# EAGLE design BUS (EAGLE 9.5.2)
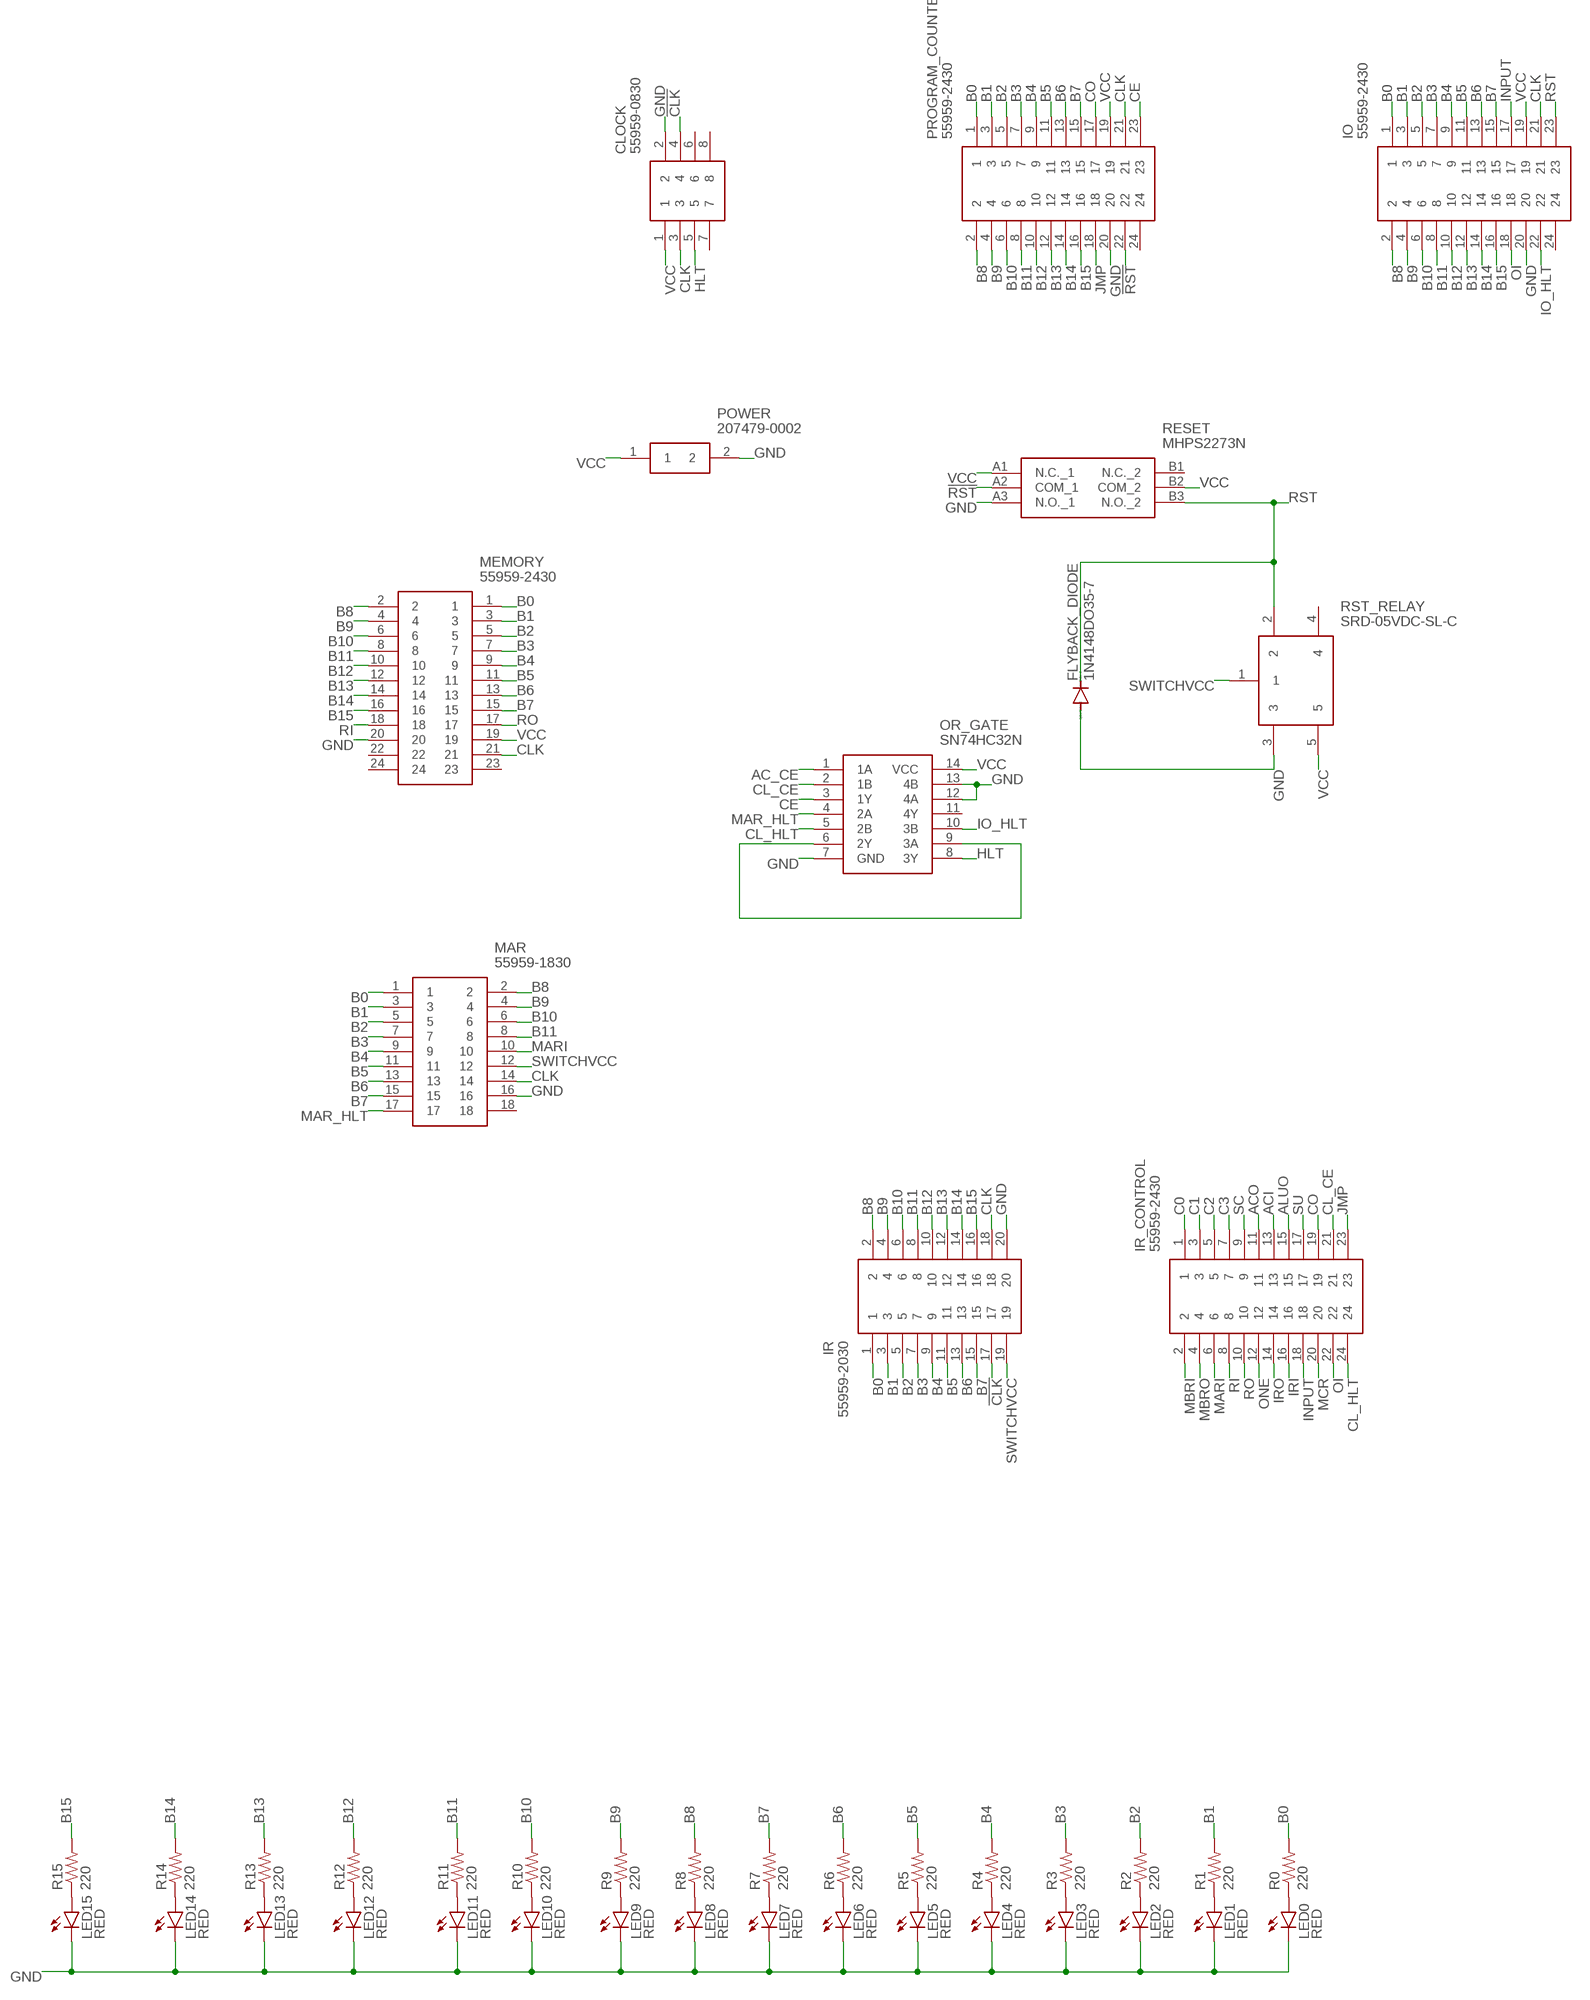
[diagram p0: schematic, sheet 1, part 1 of 2]
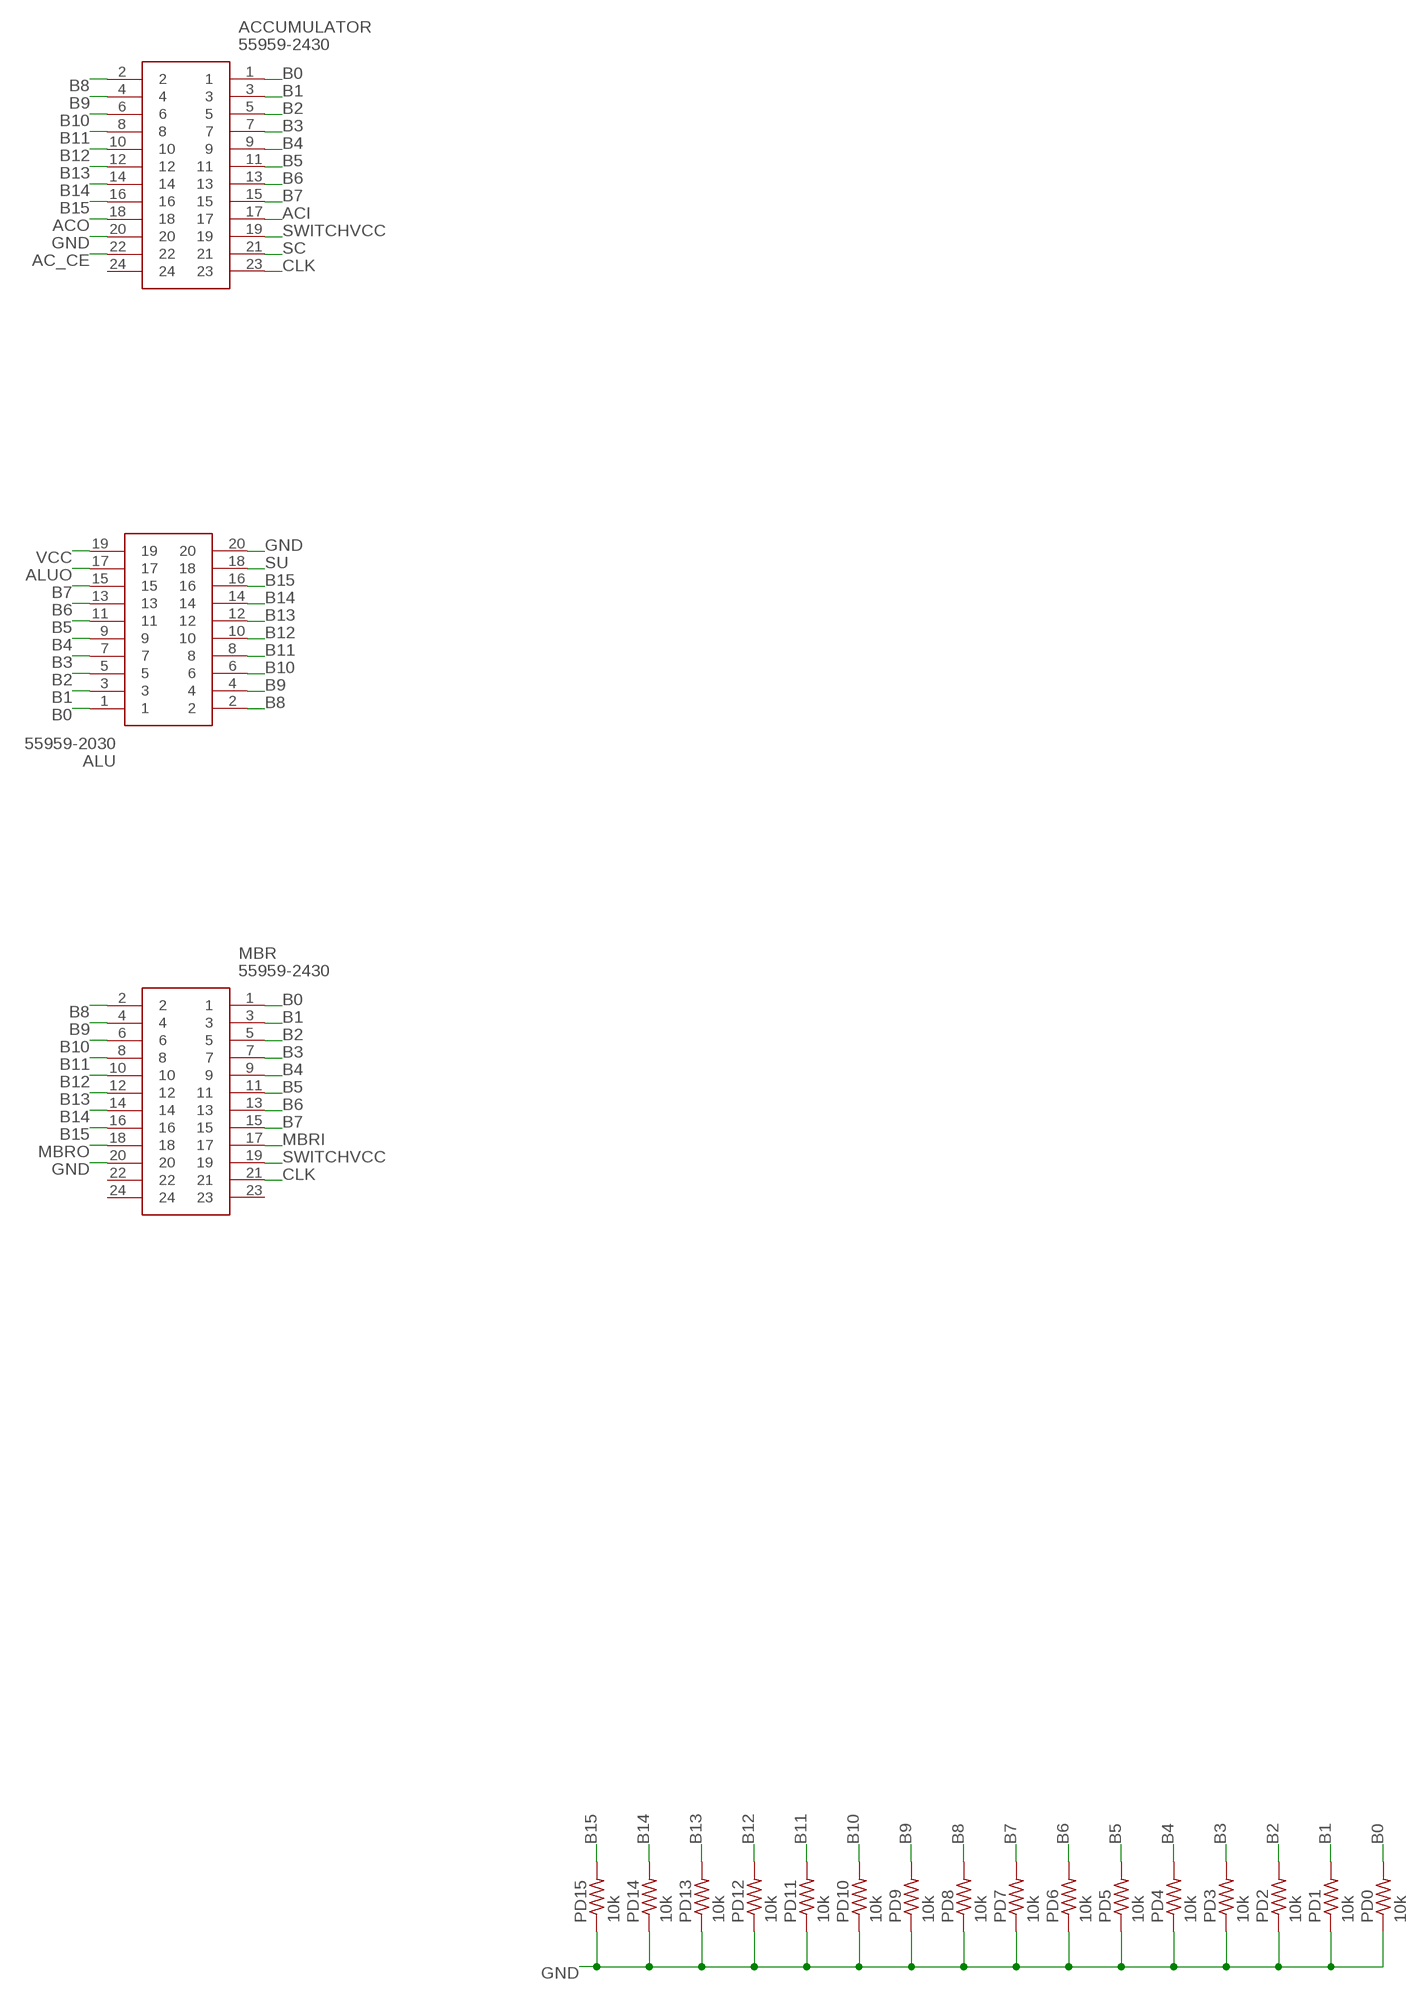
[diagram p1: schematic, sheet 1, part 2 of 2]

## Parts
ACCUMULATOR  55959-2430  [559592430]
ALU  55959-2030  [55959-2030_1]
CLOCK  55959-0830  [SHDR8W65P250X200_2X4_1140X1400]
FLYBACK_DIODE  1N4148DO35-7  [DO35-7]
IO  55959-2430  [559592430]
IR  55959-2030  [55959-2030_1]
IR_CONTROL  55959-2430  [559592430]
LED0  RED  LED3MM  [LED3MM]
LED1  RED  LED3MM  [LED3MM]
LED2  RED  LED3MM  [LED3MM]
LED3  RED  LED3MM  [LED3MM]
LED4  RED  LED3MM  [LED3MM]
LED5  RED  LED3MM  [LED3MM]
LED6  RED  LED3MM  [LED3MM]
LED7  RED  LED3MM  [LED3MM]
LED8  RED  LED3MM  [LED3MM]
LED9  RED  LED3MM  [LED3MM]
LED10  RED  LED3MM  [LED3MM]
LED11  RED  LED3MM  [LED3MM]
LED12  RED  LED3MM  [LED3MM]
LED13  RED  LED3MM  [LED3MM]
LED14  RED  LED3MM  [LED3MM]
LED15  RED  LED3MM  [LED3MM]
MAR  55959-1830  [SHDR18W65P250X200_2X9_2140X140]
MBR  55959-2430  [559592430]
MEMORY  55959-2430  [559592430]
OR_GATE  SN74HC32N  [DIP794W53P254L1930H508Q14N]
PD0  10k  R-US_0204/7  [0204/7]
PD1  10k  R-US_0204/7  [0204/7]
PD2  10k  R-US_0204/7  [0204/7]
PD3  10k  R-US_0204/7  [0204/7]
PD4  10k  R-US_0204/7  [0204/7]
PD5  10k  R-US_0204/7  [0204/7]
PD6  10k  R-US_0204/7  [0204/7]
PD7  10k  R-US_0204/7  [0204/7]
PD8  10k  R-US_0204/7  [0204/7]
PD9  10k  R-US_0204/7  [0204/7]
PD10  10k  R-US_0204/7  [0204/7]
PD11  10k  R-US_0204/7  [0204/7]
PD12  10k  R-US_0204/7  [0204/7]
PD13  10k  R-US_0204/7  [0204/7]
PD14  10k  R-US_0204/7  [0204/7]
PD15  10k  R-US_0204/7  [0204/7]
POWER  207479-0002  [2074790002]
PROGRAM_COUNTER  55959-2430  [559592430]
R0  220  R-US_0204/7  [0204/7]
R1  220  R-US_0204/7  [0204/7]
R2  220  R-US_0204/7  [0204/7]
R3  220  R-US_0204/7  [0204/7]
R4  220  R-US_0204/7  [0204/7]
R5  220  R-US_0204/7  [0204/7]
R6  220  R-US_0204/7  [0204/7]
R7  220  R-US_0204/7  [0204/7]
R8  220  R-US_0204/7  [0204/7]
R9  220  R-US_0204/7  [0204/7]
R10  220  R-US_0204/7  [0204/7]
R11  220  R-US_0204/7  [0204/7]
R12  220  R-US_0204/7  [0204/7]
R13  220  R-US_0204/7  [0204/7]
R14  220  R-US_0204/7  [0204/7]
R15  220  R-US_0204/7  [0204/7]
RESET  MHPS2273N  [MHPS2273N]
RST_RELAY  SRD-05VDC-SL-C  [SRD]

## Nets
!CLK: CLOCK.4 IR.17
!RST: PROGRAM_COUNTER.22 RESET.A2(COM_1)
AC_CE: ACCUMULATOR.22 OR_GATE.1(1A)
ACI: ACCUMULATOR.17 IR_CONTROL.13
ACO: ACCUMULATOR.18 IR_CONTROL.11
ALUO: ALU.17 IR_CONTROL.15
B0: ACCUMULATOR.1 ALU.1 IO.1 IR.1 MAR.1 MBR.1 MEMORY.1 PD0.2 PROGRAM_COUNTER.1 R0.2
B1: ACCUMULATOR.3 ALU.3 IO.3 IR.3 MAR.3 MBR.3 MEMORY.3 PD1.2 PROGRAM_COUNTER.3 R1.2
B2: ACCUMULATOR.5 ALU.5 IO.5 IR.5 MAR.5 MBR.5 MEMORY.5 PD2.2 PROGRAM_COUNTER.5 R2.2
B3: ACCUMULATOR.7 ALU.7 IO.7 IR.7 MAR.7 MBR.7 MEMORY.7 PD3.2 PROGRAM_COUNTER.7 R3.2
B4: ACCUMULATOR.9 ALU.9 IO.9 IR.9 MAR.9 MBR.9 MEMORY.9 PD4.2 PROGRAM_COUNTER.9 R4.2
B5: ACCUMULATOR.11 ALU.11 IO.11 IR.11 MAR.11 MBR.11 MEMORY.11 PD5.2 PROGRAM_COUNTER.11 R5.2
B6: ACCUMULATOR.13 ALU.13 IO.13 IR.13 MAR.13 MBR.13 MEMORY.13 PD6.2 PROGRAM_COUNTER.13 R6.2
B7: ACCUMULATOR.15 ALU.15 IO.15 IR.15 MAR.15 MBR.15 MEMORY.15 PD7.2 PROGRAM_COUNTER.15 R7.2
B8: ACCUMULATOR.2 ALU.2 IO.2 IR.2 MAR.2 MBR.2 MEMORY.2 PD8.2 PROGRAM_COUNTER.2 R8.2
B9: ACCUMULATOR.4 ALU.4 IO.4 IR.4 MAR.4 MBR.4 MEMORY.4 PD9.2 PROGRAM_COUNTER.4 R9.2
B10: ACCUMULATOR.6 ALU.6 IO.6 IR.6 MAR.6 MBR.6 MEMORY.6 PD10.2 PROGRAM_COUNTER.6 R10.2
B11: ACCUMULATOR.8 ALU.8 IO.8 IR.8 MAR.8 MBR.8 MEMORY.8 PD11.2 PROGRAM_COUNTER.8 R11.2
B12: ACCUMULATOR.10 ALU.10 IO.10 IR.10 MBR.10 MEMORY.10 PD12.2 PROGRAM_COUNTER.10 R12.2
B13: ACCUMULATOR.12 ALU.12 IO.12 IR.12 MBR.12 MEMORY.12 PD13.2 PROGRAM_COUNTER.12 R13.2
B14: ACCUMULATOR.14 ALU.14 IO.14 IR.14 MBR.14 MEMORY.14 PD14.2 PROGRAM_COUNTER.14 R14.2
B15: ACCUMULATOR.16 ALU.16 IO.16 IR.16 MBR.16 MEMORY.16 PD15.2 PROGRAM_COUNTER.16 R15.2
C0: IR_CONTROL.1
C1: IR_CONTROL.3
C2: IR_CONTROL.5
C3: IR_CONTROL.7
CE: OR_GATE.3(1Y) PROGRAM_COUNTER.23
CL_CE: IR_CONTROL.21 OR_GATE.2(1B)
CL_HLT: IR_CONTROL.24 OR_GATE.5(2B)
CLK: ACCUMULATOR.23 CLOCK.3 IO.21 IR.18 MAR.14 MBR.21 MEMORY.21 PROGRAM_COUNTER.21
CO: IR_CONTROL.19 PROGRAM_COUNTER.17
GND: ACCUMULATOR.20 ALU.20 CLOCK.2 FLYBACK_DIODE.A IO.20 IR.20 LED0.K(C) LED1.K(C) LED2.K(C) LED3.K(C) LED4.K(C) LED5.K(C) LED6.K(C) LED7.K(C) LED8.K(C) LED9.K(C) LED10.K(C) LED11.K(C) LED12.K(C) LED13.K(C) LED14.K(C) LED15.K(C) MAR.16 MBR.20 MEMORY.20 OR_GATE.7(GND) OR_GATE.12(4A) OR_GATE.13(4B) PD0.1 PD1.1 PD2.1 PD3.1 PD4.1 PD5.1 PD6.1 PD7.1 PD8.1 PD9.1 PD10.1 PD11.1 PD12.1 PD13.1 PD14.1 PD15.1 POWER.2 PROGRAM_COUNTER.20 RESET.A3(N.O._1) RST_RELAY.3
HLT: CLOCK.5 OR_GATE.8(3Y)
INPUT: IO.17 IR_CONTROL.18
IO_HLT: IO.22 OR_GATE.10(3B)
IRI: IR_CONTROL.16
IRO: IR_CONTROL.14
JMP: IR_CONTROL.23 PROGRAM_COUNTER.18
MAR_HLT: MAR.17 OR_GATE.4(2A)
MARI: IR_CONTROL.6 MAR.10
MBRI: IR_CONTROL.2 MBR.17
MBRO: IR_CONTROL.4 MBR.18
MCR: IR_CONTROL.20
N$1: LED1.A R1.1
N$2: LED2.A R2.1
N$3: LED3.A R3.1
N$4: LED4.A R4.1
N$5: LED5.A R5.1
N$6: LED6.A R6.1
N$7: LED7.A R7.1
N$8: LED8.A R8.1
N$11: OR_GATE.6(2Y) OR_GATE.9(3A)
N$13: LED9.A R9.1
N$14: LED10.A R10.1
N$15: LED11.A R11.1
N$16: LED12.A R12.1
N$17: LED13.A R13.1
N$18: LED14.A R14.1
N$19: LED15.A R15.1
N$20: LED0.A R0.1
OI: IO.18 IR_CONTROL.22
ONE: IR_CONTROL.12
RI: IR_CONTROL.8 MEMORY.18
RO: IR_CONTROL.10 MEMORY.17
RST: FLYBACK_DIODE.C IO.23 RESET.B3(N.O._2) RST_RELAY.2
SC: ACCUMULATOR.21 IR_CONTROL.9
SU: ALU.18 IR_CONTROL.17
SWITCHVCC: ACCUMULATOR.19 IR.19 MAR.12 MBR.19 RST_RELAY.1
VCC: ALU.19 CLOCK.1 IO.19 MEMORY.19 OR_GATE.14(VCC) POWER.1 PROGRAM_COUNTER.19 RESET.A1(N.C._1) RESET.B2(COM_2) RST_RELAY.5
Unconnected: ACCUMULATOR.24 CLOCK.6 CLOCK.7 CLOCK.8 IO.24 MAR.18 MBR.22 MBR.23 MBR.24 MEMORY.22 MEMORY.23 MEMORY.24 OR_GATE.11(4Y) PROGRAM_COUNTER.24 RESET.B1(N.C._2) RST_RELAY.4

## Library data of the parts
ACCUMULATOR IO IR_CONTROL MBR MEMORY PROGRAM_COUNTER = SamacSys_Parts:55959-2430: Headers & Wire Housings 24 Ckt R.A. Header Source: Datasheet <https://componentsearchengine.com/Datasheets/1/55959-2430.pdf>; DESCRIPTION: Headers & Wire Housings 24 Ckt R.A. Header; HEIGHT: 11.95mm; MANUFACTURER_NAME: Molex; MANUFACTURER_PART_NUMBER: 55959-2430; MOUSER_PART_NUMBER: 538-55959-2430; MOUSER_PRICE-STOCK: https://www.mouser.com/Search/Refine.aspx?Keyword=538-55959-2430
ALU IR = SamacSys_Parts:55959-2030: Molex MICROCLASP Series, Series Number 56134, 2mm Pitch 20 Way 2 Row Right Angle PCB Header, Solder Termination, 3A Source: Datasheet <https://componentsearchengine.com/Datasheets/1/55959-2030.pdf>; DESCRIPTION: Molex MICROCLASP Series, Series Number 56134, 2mm Pitch 20 Way 2 Row Right Angle PCB Header, Solder Termination, 3A; HEIGHT: mm; MANUFACTURER_NAME: Molex; MANUFACTURER_PART_NUMBER: 55959-2030; MOUSER_PART_NUMBER: 538-55959-2030; MOUSER_PRICE-STOCK: https://www.mouser.com/Search/Refine.aspx?Keyword=538-55959-2030
CLOCK = SamacSys_Parts:55959-0830: Headers & Wire Housings 8 Ckt R.A. Header Source: Datasheet <https://componentsearchengine.com/Datasheets/1/55959-0830.pdf>; DESCRIPTION: Headers & Wire Housings 8 Ckt R.A. Header; HEIGHT: 11.95mm; MANUFACTURER_NAME: Molex; MANUFACTURER_PART_NUMBER: 55959-0830; MOUSER_PART_NUMBER: 538-55959-0830; MOUSER_PRICE-STOCK: https://www.mouser.com/Search/Refine.aspx?Keyword=538-55959-0830
FLYBACK_DIODE = diode:1N4148: DIODE high speed (Philips)
LED0 LED1-LED15 = led:LED: LED OSRAM: - CHIPLED LG R971, LG N971, LY N971, LG Q971, LY Q971, LO R971, LY R971 LH N974, LH R974 LS Q976, LO Q976, LY Q976 LO Q996 - Hyper CHIPLED LW Q18S LB Q993, LB Q99A, LB R99A - SideLED LS A670, LO A670, LY A670, LG A670, LP A670 LB A673, LV A673, LT A673, LW A673 LH A674 LY A675 LS A676, LA A676, LO A676, LY A676, LW A676 LS A679, LY A679, LG A679 - Hyper Micro SIDELED® LS Y876, LA Y876, LO Y876, LY Y876 LT Y87S - SmartLED LW L88C, LW L88S LB L89C, LB L89S, LG L890 LS L89K, LO L89K, LY L89K LS L896, LA L896, LO L896, LY L896 - TOPLED LS T670, LO T670, LY T670, LG T670, LP T670 LSG T670, LSP T670, LSY T670, LOP T670, LYG T670 LG T671, LOG T671, LSG T671 LB T673, LV T673, LT T673, LW T673 LH T674 LS T676, LA T676, LO T676, LY T676, LB T676, LH T676, LSB T676, LW T676 LB T67C, LV T67C, LT T67C, LS T67K, LO T67K, LY T67K, LW E67C LS E67B, LA E67B, LO E67B, LY E67B, LB E67C, LV E67C, LT E67C LW T67C LS T679, LY T679, LG T679 LS T770, LO T770, LY T770, LG T770, LP T770 LB T773, LV T773, LT T773, LW T773 LH T774 LS E675, LA E675, LY E675, LS T675 LS T776, LA T776, LO T776, LY T776, LB T776 LHGB T686 LT T68C, LB T68C - Hyper Mini TOPLED® LB M676 - Mini TOPLED Santana® LG M470 LS M47K, LO M47K, LY M47K Source: http://www.osram.convergy.de LUXEON: - LUMILED® LXK2-PW12-R00, LXK2-PW12-S00, LXK2-PW14-U00, LXK2-PW14-V00 LXK2-PM12-R00, LXK2-PM12-S00, LXK2-PM14-U00 LXK2-PE12-Q00, LXK2-PE12-R00, LXK2-PE12-S00, LXK2-PE14-T00, LXK2-PE14-U00 LXK2-PB12-K00, LXK2-PB12-L00, LXK2-PB12-M00, LXK2-PB14-N00, LXK2-PB14-P00, LXK2-PB14-Q00 LXK2-PR12-L00, LXK2-PR12-M00, LXK2-PR14-Q00, LXK2-PR14-R00 LXK2-PD12-Q00, LXK2-PD12-R00, LXK2-PD12-S00 LXK2-PH12-R00, LXK2-PH12-S00 LXK2-PL12-P00, LXK2-PL12-Q00, LXK2-PL12-R00 Source: www.luxeon.com KINGBRIGHT: KA-3528ASYC Source: www.kingbright.com
MAR = SamacSys_Parts:55959-1830: Molex MICROCLASP Series, Series Number 55959, 2mm Pitch 18 Way 2 Row Right Angle PCB Header, Solder Termination, 3A Source: Datasheet <https://componentsearchengine.com/Datasheets/1/55959-1830.pdf>; DESCRIPTION: Molex MICROCLASP Series, Series Number 55959, 2mm Pitch 18 Way 2 Row Right Angle PCB Header, Solder Termination, 3A; HEIGHT: 11.7mm; MANUFACTURER_NAME: Molex; MANUFACTURER_PART_NUMBER: 55959-1830; MOUSER_PART_NUMBER: 538-55959-1830; MOUSER_PRICE-STOCK: https://www.mouser.com/Search/Refine.aspx?Keyword=538-55959-1830
OR_GATE = SamacSys_Parts:SN74HC32N: QUADRUPLE 2-INPUT POSITIVE-OR GATES Source: Datasheet <http://www.ti.com/lit/gpn/sn74hc32>; DESCRIPTION: QUADRUPLE 2-INPUT POSITIVE-OR GATES; HEIGHT: 5.08mm; MANUFACTURER_NAME: Texas Instruments; MANUFACTURER_PART_NUMBER: SN74HC32N; MOUSER_PART_NUMBER: 595-SN74HC32N; MOUSER_PRICE-STOCK: https://www.mouser.com/Search/Refine.aspx?Keyword=595-SN74HC32N
PD0 PD1-PD15 R0 R1-R15 = rcl:R-US_: RESISTOR, American symbol; SPICEPREFIX: R
POWER = SamacSys_Parts:207479-0002: MOLEX - 207479-0002 - L1NK 396 SHROUDED HEADER ASSEMBLY-1X2 98AC8497 Source: Datasheet <https://componentsearchengine.com/Datasheets/1/207479-0002.pdf>; DESCRIPTION: MOLEX - 207479-0002 - L1NK 396 SHROUDED HEADER ASSEMBLY-1X2 98AC8497; HEIGHT: 14.1mm; MANUFACTURER_NAME: Molex; MANUFACTURER_PART_NUMBER: 207479-0002; MOUSER_PART_NUMBER: 538-207479-0002; MOUSER_PRICE-STOCK: https://www.mouser.com/Search/Refine.aspx?Keyword=538-207479-0002
RESET = SamacSys_Parts:MHPS2273N: Pushbutton Switches Momentary key DP Source: Datasheet <https://componentsearchengine.com/Datasheets/1/MHPS2273N.pdf>; DESCRIPTION: Pushbutton Switches Momentary key DP; HEIGHT: 13.5mm; MANUFACTURER_NAME: Apem; MANUFACTURER_PART_NUMBER: MHPS2273N; MOUSER_PART_NUMBER: 642-MHPS2273N; MOUSER_PRICE-STOCK: https://www.mouser.com/Search/Refine.aspx?Keyword=642-MHPS2273N
RST_RELAY = SamacSys_Parts:SRD-05VDC-SL-C: Relay Source: Datasheet <http://files.microjpm.webnode.com/200001010-dda41de9e1/Songle Relay Datasheet.pdf>; DESCRIPTION: Relay; HEIGHT: mm; MANUFACTURER_NAME: Songle Relay; MANUFACTURER_PART_NUMBER: SRD-05VDC-SL-C

## Board
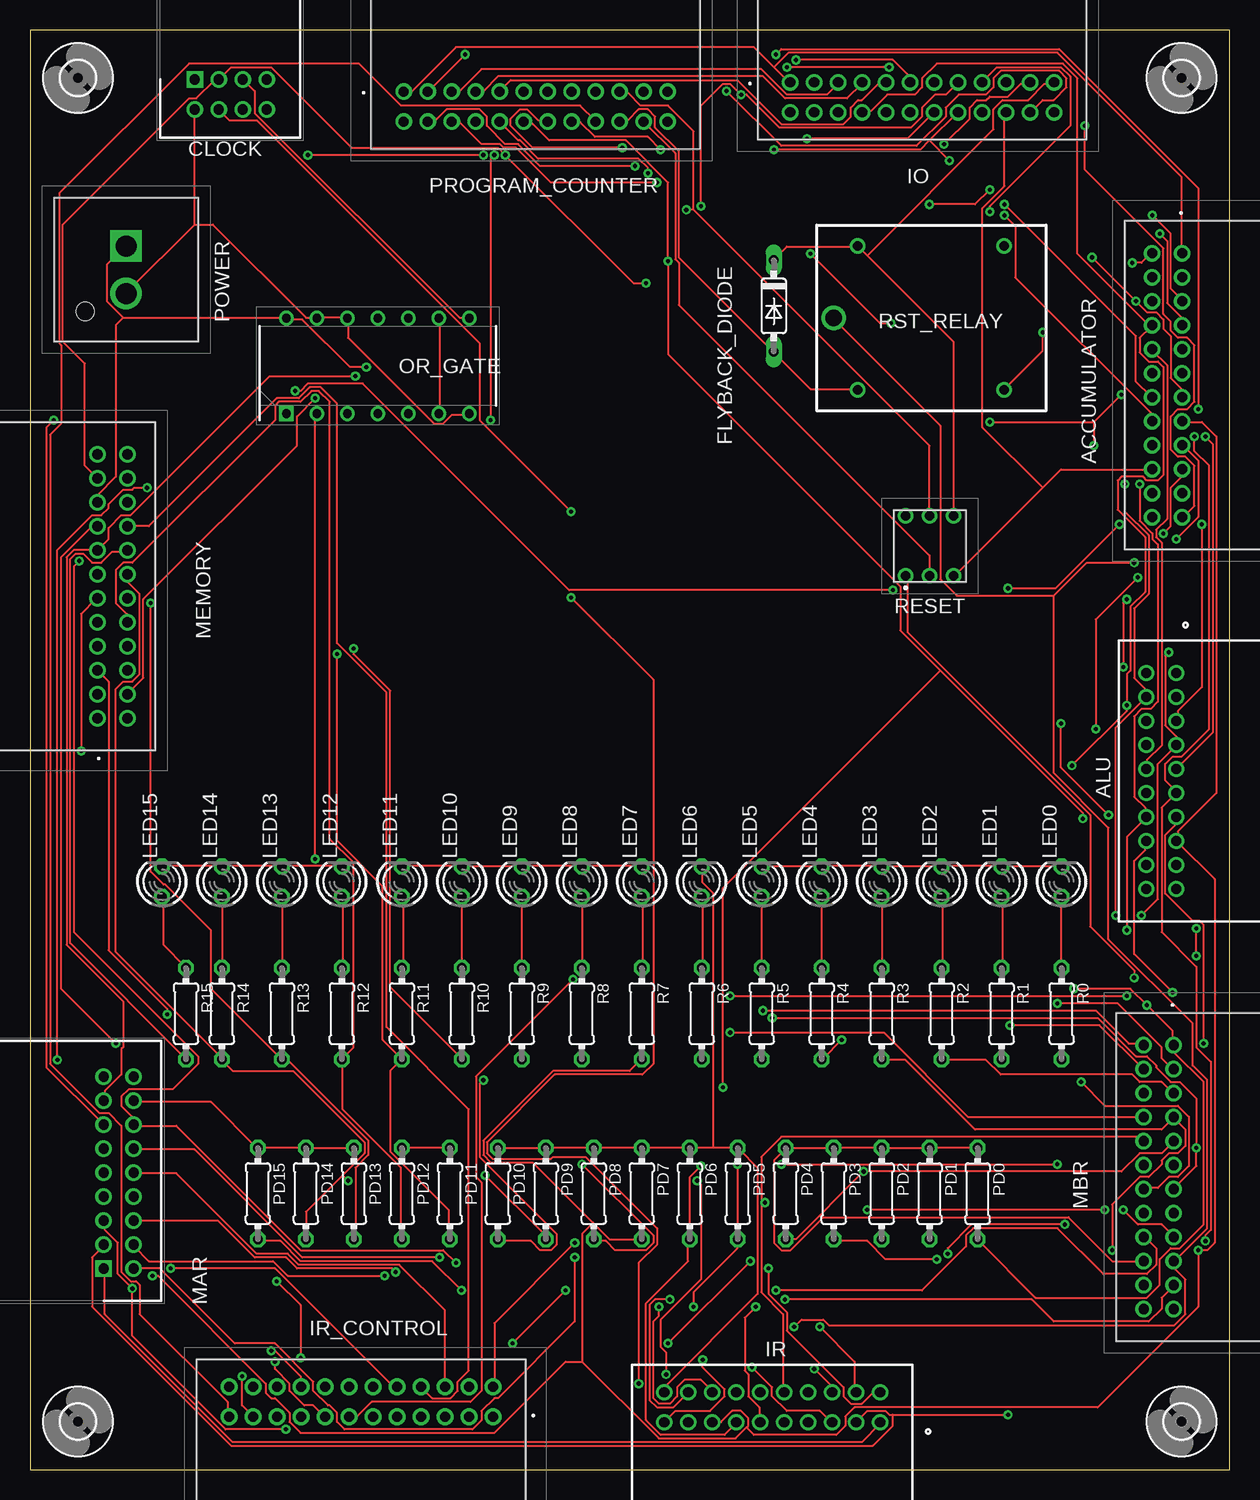
[diagram p2: board, top side]
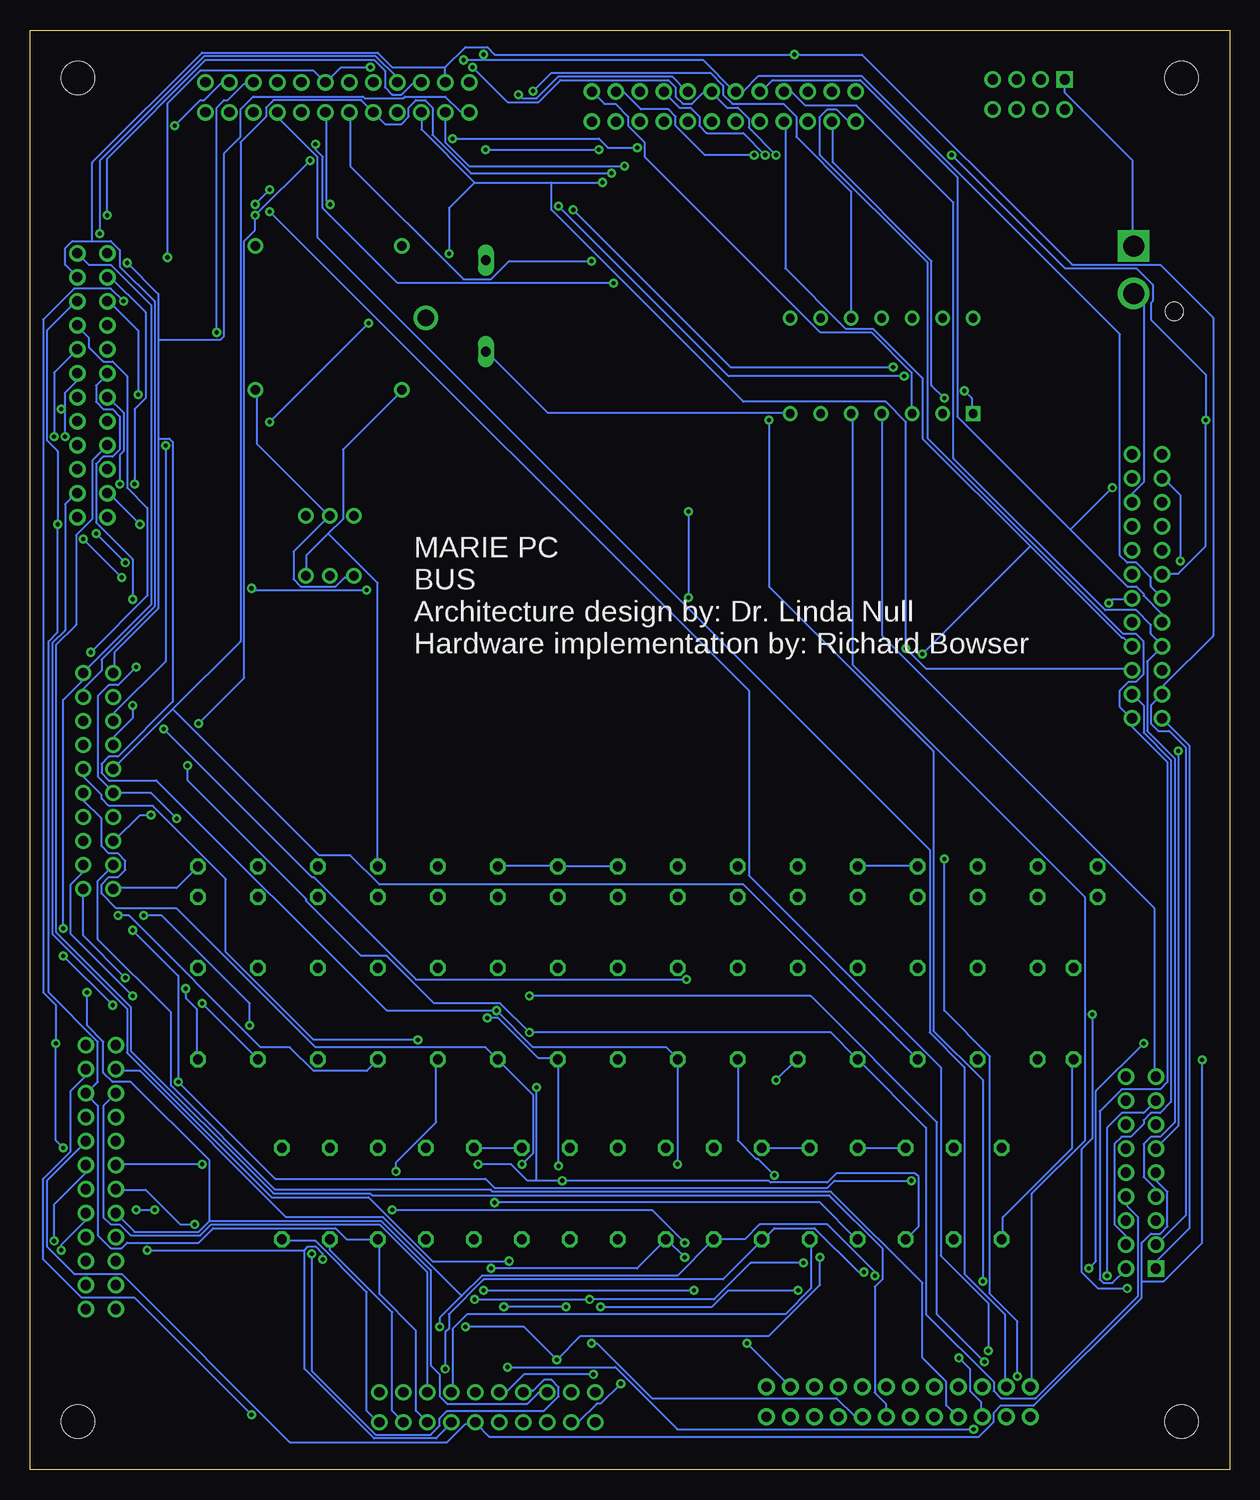
[diagram p3: board, bottom side, seen from below]

Size 100 x 120 mm. Coordinates in mm from the lower left corner, seen from the top.
Outline: 0,0 100,0 100,120 0,120 0,0
Copper layers (1*16): Top 0.035mm / dielectric 1.5mm / Bottom 0.035mm
Design rules "default": minimum track width 6mil, minimum drill 0.35mm, track to track 6mil, track to pad 6mil, pad to pad 6mil, via to via 6mil, smd to smd 6mil, copper to edge 40mil, drill to drill 6mil, minimum pad ring 10mil, minimum via ring 8mil, stop-mask expansion 4mil, vias tented up to drill 0mil, thermal gap 10mil

### Footprints (pad centres in the part's own frame; a part is rotated, then mirrored left to right if it is on the bottom)
559592430 = drill 0.85 pad 1.381: 1 0,0; 2 0,-2.5; 3 2,0; 4 2,-2.5; 5 4,0; 6 4,-2.5; 7 6,0; 8 6,-2.5; 9 8,0; 10 8,-2.5; 11 10,0; 12 10,-2.5; 13 12,0; 14 12,-2.5; 15 14,0; 16 14,-2.5; 17 16,0; 18 16,-2.5; 19 18,0; 20 18,-2.5; 21 20,0; 22 20,-2.5; 23 22,0; 24 22,-2.5
55959-2030_1 = drill 0.85 pad 1.35: 1 -9,-9.2; 2 -9,-11.7; 3 -7,-9.2; 4 -7,-11.7; 5 -5,-9.2; 6 -5,-11.7; 7 -3,-9.2; 8 -3,-11.7; 9 -1,-9.2; 10 -1,-11.7; 11 1,-9.2; 12 1,-11.7; 13 3,-9.2; 14 3,-11.7; 15 5,-9.2; 16 5,-11.7; 17 7,-9.2; 18 7,-11.7; 19 9,-9.2; 20 9,-11.7
SHDR8W65P250X200_2X4_1140X1400 = drill 0.85 pad 1.275 square: 1 0,0 | drill 0.85 pad 1.275: 2 0,-2.5; 3 2,0; 4 2,-2.5; 5 4,0; 6 4,-2.5; 7 6,0; 8 6,-2.5
DO35-7 = drill 0.813 long: A 3.81,0; C -3.81,0
LED3MM = drill 0.813 octagon: A -1.27,0; K 1.27,0
SHDR18W65P250X200_2X9_2140X140 = drill 0.85 pad 1.275 square: 1 0,0 | drill 0.85 pad 1.275: 2 0,-2.5; 3 2,0; 4 2,-2.5; 5 4,0; 6 4,-2.5; 7 6,0; 8 6,-2.5; 9 8,0; 10 8,-2.5; 11 10,0; 12 10,-2.5; 13 12,0; 14 12,-2.5; 15 14,0; 16 14,-2.5; 17 16,0; 18 16,-2.5
DIP794W53P254L1930H508Q14N = drill 0.73 pad 1.13 square: 1 -3.97,7.62 | drill 0.73 pad 1.13: 2 -3.97,5.08; 3 -3.97,2.54; 4 -3.97,0; 5 -3.97,-2.54; 6 -3.97,-5.08; 7 -3.97,-7.62; 8 3.97,-7.62; 9 3.97,-5.08; 10 3.97,-2.54; 11 3.97,0; 12 3.97,2.54; 13 3.97,5.08; 14 3.97,7.62
0204/7 = drill 0.813 octagon: 1 -3.81,0; 2 3.81,0
2074790002 = drill 1.75 pad 2.625 square: 1 0,0 | drill 1.75 pad 2.625: 2 -3.96,0 | hole 1.5: -5.46,3.4
MHPS2273N = drill 0.8 pad 1.3: A1 -2,-2.5; A2 0,-2.5; A3 2,-2.5; B1 -2,2.5; B2 0,2.5; B3 2,2.5
SRD = drill 1.34 pad 1.84: 1 0,0 | drill 0.8 pad 1.3: 2 2,6; 3 2,-6; 4 14.2,6; 5 14.2,-6
2,8 = hole 2.8: 0,0

### Placement (x,y rotation side)
ACCUMULATOR  96.05,101.39 270 top
ALU  104.77,57.4 270 top
CLOCK  13.74,115.88 0 top
FLYBACK_DIODE  62,97 270 top
IO  63.38,115.64 0 top
IR  61.88,-5.26 180 top
IR_CONTROL  38.61,4.39 180 top
LED0  86,49 90 top
LED1  81,49 90 top
LED2  76,49 90 top
LED3  71,49 90 top
LED4  66,49 90 top
LED5  61,49 90 top
LED6  56,49 90 top
LED7  51,49 90 top
LED8  46,49 90 top
LED9  41,49 90 top
LED10  36,49 90 top
LED11  31,49 90 top
LED12  26,49 90 top
LED13  21,49 90 top
LED14  16,49 90 top
LED15  11,49 90 top
MAR  6.13,16.74 90 top
MBR  95.35,35.37 270 top
MEMORY  5.63,62.63 90 top
OR_GATE  29,92 90 top
PD0  79,23 270 top
PD1  75,23 270 top
PD2  71,23 270 top
PD3  67,23 270 top
PD4  63,23 270 top
PD5  59,23 270 top
PD6  55,23 270 top
PD7  51,23 270 top
PD8  47,23 270 top
PD9  43,23 270 top
PD10  39,23 270 top
PD11  35,23 270 top
PD12  31,23 270 top
PD13  27,23 270 top
PD14  23,23 270 top
PD15  19,23 270 top
POWER  8,102 90 top
PROGRAM_COUNTER  31.15,114.86 0 top
R0  86,38 270 top
R1  81,38 270 top
R2  76,38 270 top
R3  71,38 270 top
R4  66,38 270 top
R5  61,38 270 top
R6  56,38 270 top
R7  51,38 270 top
R8  46,38 270 top
R9  41,38 270 top
R10  36,38 270 top
R11  31,38 270 top
R12  26,38 270 top
R13  21,38 270 top
R14  16,38 270 top
R15  13,38 270 top
RESET  75,77 0 top
RST_RELAY  67,96 0 top
U$1  [2,8]  4,4 0 top
U$2  [2,8]  96,4 0 top
U$3  [2,8]  96,116 0 top
U$4  [2,8]  4,116 0 top

### Tracks (layer width: path | path; a pad name or v marks a point on that pad's centre or on a via)
!CLK  (via drill 0.35)
  Top 0.152: v50.75,7.16 50.75,17.22 52.27,18.75 52.27,20.12 46.33,26.06 43.59,26.06 43.43,25.91 38.56,25.91 38.1,26.36 38.1,27.28 43.74,32.92 51.05,32.92 51.97,33.83 51.97,65.84 v45.11,72.69 | v45.11,79.86 37.49,87.48 37.49,93.88 18.9,112.47 16.61,112.47 15.85,113.23 CLOCK.4
  Bottom 0.152: v50.75,7.16 52.43,5.49 52.73,5.49 54.25,3.96 54.86,3.96 IR.17 | v45.11,79.86 v45.11,72.69
!RST
  Top 0.152: RESET.A2 74.98,74.52 74.98,76.2 54.1,97.08 54.1,100.58 53.8,100.89 53.8,109.73 51.21,112.32 PROGRAM_COUNTER.22
AC_CE  (via drill 0.35)
  Top 0.152: v22.1,89.92 22.55,89.92 23.16,90.53 27.74,90.53 44.96,73.3 v71.93,73.3 | v81.53,73.46 85.5,73.46 v90.83,78.79
  Bottom 0.152: v22.1,89.92 21.49,89.31 21.49,88.09 OR_GATE.1 | v71.93,73.3 81.38,73.3 v81.53,73.46 | v90.83,78.79 93.42,81.38 ACCUMULATOR.22
ACI  (via drill 0.35)
  Top 0.152: v45.26,40.84 37.19,32.77 37.19,24.38 37.64,23.93 37.64,6.55 36.73,5.64 28.5,5.64 27.28,4.42 26.67,4.42 IR_CONTROL.13 | v88.85,61.72 88.85,70.87 v92.35,74.37 | v95.56,77.57 97.38,79.4 97.38,84.12 96.16,85.34 ACCUMULATOR.17
  Bottom 0.152: v45.26,40.84 67.82,40.84 76.35,49.38 76.5,49.38 v88.85,61.72 | v95.56,77.57 v92.35,74.37
ACO
  Bottom 0.152: IR_CONTROL.11 28.65,4.42 28.65,5.49 29.57,6.4 29.57,15.24 28.96,15.85 28.96,18.44 33.38,22.86 71.48,22.86 71.63,23.01 79.7,23.01 91.59,34.9 91.59,38.56 97.84,44.81 97.84,68.73 96.16,70.41 96.16,77.88 94.79,79.25 94.79,84.12 93.57,85.34 ACCUMULATOR.18
ALUO  (via drill 0.35)
  Top 0.152: v58.37,39.47 v91.44,39.47 | v20.42,8.99 20.42,8.38 21.64,7.16 21.64,6.55 22.86,5.33 23.62,5.33 24.54,4.42 IR_CONTROL.15
  Bottom 0.152: v91.44,39.47 96.62,44.65 96.62,48.77 95.71,49.68 95.71,50.29 ALU.17 | v58.37,39.47 34.9,39.47 24.38,28.96 24.38,12.95 v20.42,8.99
B0  (via drill 0.35)
  Top 0.152: 62.03,116.89 63.25,115.67 IO.1 | 62.03,116.89 60.35,118.57 35.51,118.57 31.85,114.91 31.24,114.91 PROGRAM_COUNTER.1 | 62.03,116.89 63.25,118.11 85.65,118.11 96.01,107.75 96.01,101.5 ACCUMULATOR.1 | v87.02,40.08 91.75,40.08 v93.12,38.71 95.25,36.58 95.25,35.51 MBR.1 95.4,35.36 95.4,34.75 97.84,32.31 97.84,20.42 95.86,18.44 95.1,18.44 94.18,17.53 94.18,15.39 93.12,14.33 83.82,14.33 79.1,19.05 PD0.2 | MAR.1 6.25,16.61 6.25,12.95 16.92,2.29 69.34,2.29 70.87,3.81 IR.1 | v97.23,42.82 v97.23,45.11
  Bottom 0.152: ACCUMULATOR.1 96.01,101.35 95.1,100.43 93.27,100.43 89.92,97.08 89.92,72.08 95.56,66.45 ALU.1 95.71,66.29 95.71,65.68 97.23,64.16 v97.23,45.11 | MAR.1 6.1,16.76 6.1,17.37 3.35,20.12 3.35,60.35 5.49,62.48 MEMORY.1 | v87.02,40.08 87.02,39.32 86.11,38.41 86.11,34.29 R0.2 | PD0.2 78.94,19.05 76.2,19.05 71.93,14.78 71.93,4.88 71.02,3.96 IR.1 | v93.12,38.71 v97.23,42.82
B1  (via drill 0.35)
  Top 0.152: v85.65,38.86 90.68,38.86 94.34,35.2 94.34,34.29 95.25,33.38 MBR.3 | 71.93,4.57 71.63,4.57 71.32,4.88 69.8,4.88 68.89,3.96 IR.3 | 71.93,4.57 v81.53,4.57 | v36.27,117.96 33.22,114.91 PROGRAM_COUNTER.3 | 71.93,4.57 71.93,3.66 70.26,1.98 16.76,1.98 5.18,13.56 5.18,17.68 6.1,18.59 MAR.3
  Bottom 0.152: v85.65,38.86 81.08,34.29 R1.2 | PD1.2 74.98,19.05 74.98,18.29 69.8,13.11 69.8,4.88 68.89,3.96 IR.3 | v81.53,4.57 91.29,14.33 95.71,14.33 98.91,17.53 98.91,24.23 96.62,26.52 96.62,31.55 95.4,32.77 95.4,33.22 MBR.3 | MAR.3 6.1,18.75 3.66,21.18 3.66,60.2 5.03,61.57 5.94,61.57 6.55,62.18 6.55,63.7 5.64,64.62 MEMORY.3 5.49,64.77 5.49,65.38 1.37,69.49 1.37,96.01 5.79,100.43 13.11,100.43 30.63,117.96 v36.27,117.96 61.27,117.96 61.87,118.57 63.7,118.57 65.38,116.89 | 65.38,116.89 65.38,115.67 IO.3 | 94.79,102.41 96.47,102.41 97.08,101.8 97.08,100.43 96.16,99.52 ACCUMULATOR.3 | 94.79,102.41 93.27,102.41 92.51,101.65 92.51,100.28 89.61,97.38 89.61,71.93 94.03,67.51 94.03,66.6 95.56,65.08 95.56,64.47 ALU.3 | 65.38,116.89 69.8,116.89 71.02,118.11 85.65,118.11 94.79,108.97 94.79,102.41
B2  (via drill 0.35)
  Top 0.152: PROGRAM_COUNTER.5 35.2,114.91 35.81,114.91 37.64,116.74 60.96,116.74 63.09,114.61 66.45,114.61 67.36,115.52 IO.5 | v97.69,78.79 97.69,65.23 95.71,63.25 95.71,62.48 ALU.5 | v93.57,104.55 95.1,103.02 95.1,98.45 96.01,97.54 ACCUMULATOR.5 | v11.43,37.95 11.43,38.41 6.55,43.28 6.55,65.68 5.64,66.6 MEMORY.5 | MAR.5 6.25,20.73 6.25,19.96 7.32,18.9 7.32,16.31 v8.53,15.09 8.53,11.12 16.31,3.35 v21.34,3.35 | R2.2 76.05,34.14 79.7,34.14 80.92,32.92 91.9,32.92 92.51,32.31 94.34,32.31 95.25,31.39 MBR.5 | v60.2,8.53 61.87,6.86 61.87,6.1 63.09,4.88 65.84,4.88 66.75,3.96 IR.5
  Bottom 0.152: ACCUMULATOR.5 96.16,97.38 98.6,94.94 98.6,85.8 97.69,84.89 v97.69,78.79 97.69,69.8 98.45,69.04 98.45,39.78 94.34,35.66 94.34,32.31 95.25,31.39 MBR.5 95.25,31.24 94.34,30.33 94.34,19.51 93.27,18.44 92.35,18.44 91.9,18.9 85.95,18.9 84.73,20.12 74.52,20.12 73.61,19.2 71.02,19.2 PD2.2 70.87,19.05 70.87,14.63 67.82,11.58 67.82,4.88 66.9,3.96 IR.5 | v93.57,104.55 93.57,109.27 85.34,117.5 71.32,117.5 70.41,116.59 70.41,115.21 69.8,114.61 69.04,114.61 68.12,115.52 67.51,115.52 IO.5 | v8.53,15.09 10.97,15.09 12.34,16.46 12.34,26.67 11.43,27.58 v11.43,37.95 | v21.34,3.35 46.02,3.35 51.21,8.53 v60.2,8.53
B3  (via drill 0.35)
  Top 0.152: v94.94,68.12 94.64,67.82 94.64,62.03 95.56,61.11 95.56,60.5 ALU.7 95.56,60.35 94.03,58.83 94.03,47.55 v92.66,46.18 | v75.59,17.53 71.32,17.53 69.8,19.05 67.06,19.05 PD3.2 | R3.2 71.02,34.14 73,34.14 78.79,28.35 94.34,28.35 95.25,29.26 MBR.7 95.4,29.26 96.32,28.35 96.32,26.98 95.71,26.36 94.94,26.36 94.34,25.76 94.34,25.45 93.27,24.38 92.51,24.38 90.22,22.1 v90.22,18.29 | PROGRAM_COUNTER.7 37.19,114.91 37.8,114.91 39.01,116.13 61.11,116.13 62.94,114.3 68.12,114.3 69.34,115.52 IO.7 | v94.18,103.02 94.79,102.41 94.79,97.23 96.01,96.01 96.01,95.4 ACCUMULATOR.7
  Bottom 0.152: v94.94,68.12 90.22,72.85 90.22,80.16 91.9,81.84 91.9,91.14 93.12,92.35 93.88,92.35 95.1,93.57 95.1,94.34 96.01,95.25 ACCUMULATOR.7 | v75.59,17.53 75.59,17.98 76.2,18.59 76.81,18.59 77.11,18.29 | 77.11,18.29 77.11,8.38 71.32,2.59 66.14,2.59 64.92,3.81 IR.7 | v90.22,18.29 77.11,18.29 | v92.66,46.18 91.75,46.18 80.77,35.2 78.33,35.2 76.35,33.22 71.93,33.22 71.02,34.14 R3.2 | MAR.7 6.25,22.86 6.25,23.47 7.16,24.38 7.16,27.13 6.55,27.74 5.79,27.74 4.57,28.96 4.57,59.28 6.86,61.57 6.86,67.36 5.64,68.58 MEMORY.7 5.64,68.73 6.55,69.65 6.55,70.41 7.77,71.63 10.36,71.63 23.01,84.28 23.01,105.61 31.09,113.69 35.36,113.69 36.42,114.76 37.03,114.76 PROGRAM_COUNTER.7 | v94.18,103.02 94.18,109.12 85.5,117.81 71.17,117.81 69.49,116.13 69.49,115.67 IO.7
B4  (via drill 0.35)
  Top 0.152: IO.9 71.32,115.52 70.71,115.52 69.34,114.15 69.04,114.15 68.43,113.54 68.43,112.78 67.82,112.17 62.64,112.17 58.98,115.82 40.08,115.82 39.17,114.91 PROGRAM_COUNTER.9 | v97.99,86.11 98.6,85.5 98.6,61.42 95.71,58.52 ALU.9 | PD4.2 63.09,19.2 63.86,19.2 v69.49,24.84 90.98,24.84 92.51,26.36 94.34,26.36 95.25,27.28 MBR.9 | v67.67,35.81 66.14,34.29 R4.2 | v9.75,81.84 8.69,81.84 8.53,81.69 7.77,81.69 6.55,80.47 6.55,80.16 5.94,79.55 5.18,79.55 2.29,76.66 v2.29,34.14
  Bottom 0.152: 13.26,78.33 22.71,87.78 22.71,107.75 30.79,115.82 38.1,115.82 39.01,114.91 PROGRAM_COUNTER.9 | 13.26,78.33 8.53,73.61 7.77,73.61 7.16,73 7.16,72.85 5.64,71.32 5.64,70.71 MEMORY.9 | v97.99,86.11 97.99,91.44 96.16,93.27 ACCUMULATOR.9 | v69.49,24.84 69.49,25.6 66.14,28.96 66.14,34.14 R4.2 | MBR.9 95.4,27.28 98.6,24.08 98.6,18.59 96.32,16.31 92.35,16.31 78.33,2.29 65.23,2.29 63.7,3.81 62.94,3.81 IR.9 62.79,3.81 61.72,2.74 20.88,2.74 19.66,3.96 19.66,4.72 19.05,5.33 16.31,5.33 7.32,14.33 7.32,15.7 | 7.32,15.7 7.32,18.9 6.55,19.66 5.79,19.66 5.18,20.27 5.18,23.16 6.1,24.08 6.1,24.69 MAR.9 | v67.67,35.81 76.35,35.81 83.67,43.13 83.67,49.23 89.76,55.32 93.42,55.32 94.03,55.93 94.03,56.24 95.56,57.76 95.56,58.37 ALU.9 | v9.75,81.84 13.26,78.33 | v2.29,34.14 2.29,18.9 5.49,15.7 7.32,15.7
B5  (via drill 0.35)
  Top 0.152: v58.98,25.45 58.98,19.2 PD5.2 58.98,19.05 58.98,18.44 55.32,14.78 v55.32,13.56 | v60.5,13.56 59.59,12.65 59.59,8.23 59.89,7.92 59.89,6.1 60.81,5.18 60.81,3.96 IR.11 | v97.99,19.05 97.99,19.51 98.45,19.96 98.45,33.98 97.23,35.2 97.23,41.91 94.34,44.81 94.34,55.17 95.56,56.39 ALU.11 95.56,56.54 94.64,57.45 94.64,58.83 95.25,59.44 96.01,59.44 98.3,61.72 98.3,83.67 97.08,84.89 v97.08,86.11 | v63.86,117.5 71.93,117.5 73.3,116.13 73.3,115.67 IO.11 | v4.27,59.89 4.27,71.32 5.49,72.54 MEMORY.11 | v97.38,88.39 97.38,106.83 85.8,118.42 62.64,118.42 v62.18,117.96
  Bottom 0.152: v58.98,25.45 58.06,26.36 58.06,31.24 60.96,34.14 R5.2 61.11,34.29 62.03,35.2 76.2,35.2 87.78,46.79 92.81,46.79 94.03,48.01 94.03,48.77 93.42,49.38 92.66,49.38 92.05,49.99 92.05,50.75 92.66,51.36 93.42,51.36 94.03,51.97 94.03,54.25 95.56,55.78 95.56,56.39 ALU.11 | v55.32,13.56 v60.5,13.56 | v97.99,19.05 97.99,22.1 95.4,24.69 95.4,25.3 MBR.11 | v97.08,86.11 97.08,88.39 | 97.08,88.39 97.08,89.76 96.16,90.68 96.16,91.29 ACCUMULATOR.11 | v63.86,117.5 62.18,117.5 | 62.18,117.5 43.89,117.5 41.3,114.91 PROGRAM_COUNTER.11 41.15,114.91 40.54,114.91 39.32,116.13 30.63,116.13 9.14,94.64 9.14,76.2 8.53,75.59 7.77,75.59 6.55,74.37 6.55,73.61 5.64,72.69 MEMORY.11 | v4.27,59.89 4.27,28.65 6.1,26.82 MAR.11 | v97.38,88.39 97.08,88.39 | 62.18,117.5 v62.18,117.96
B6  (via drill 0.35)
  Top 0.152: v97.84,35.51 97.84,45.41 97.54,45.72 96.93,45.72 94.64,48.01 94.64,52.88 95.56,53.8 95.56,54.25 ALU.13 | MBR.13 95.4,23.47 97.23,25.3 v97.23,26.82 97.23,30.94 95.86,32.31 95.1,32.31 93.88,33.53 93.88,33.68 93.12,34.44 92.2,34.44 89,37.64 v61.87,37.64 | IR.13 58.83,3.81 57.91,2.9 52.58,2.9 51.36,4.12 51.36,13.87 54.86,17.37 54.86,19.05 PD6.2 55.02,19.2 55.02,24.38 v55.93,25.3 | v1.98,87.48 1.37,86.87 1.37,33.53 6.1,28.8 MAR.13 | v71.63,116.89 v63.09,116.89 | v88.54,101.04 v92.2,97.38 93.12,96.47 93.88,96.47 94.49,95.86 94.49,95.1 95.1,94.49 95.1,90.98 96.01,90.07 96.01,89.46 ACCUMULATOR.13 | v37.8,109.58 v23.16,109.58
  Bottom 0.152: v97.23,26.82 97.84,27.43 v97.84,35.51 97.84,38.71 98.91,39.78 98.91,95.86 96.32,98.45 93.27,98.45 v92.2,97.38 | v55.93,25.3 55.93,34.14 R6.2 56.08,34.29 57.61,34.29 60.96,37.64 v61.87,37.64 | MEMORY.13 5.49,74.68 4.27,74.68 1.98,76.96 v1.98,87.48 1.98,91.29 6.55,95.86 6.55,97.23 6.4,97.38 6.4,98.75 7.77,100.13 13.72,100.13 v23.16,109.58 | v63.09,116.89 60.2,114 57.61,114 55.78,115.82 46.79,115.82 46.18,115.21 46.18,114.45 45.57,113.84 44.81,113.84 43.89,114.76 43.28,114.76 PROGRAM_COUNTER.13 43.13,114.76 41.91,113.54 41,113.54 40.08,112.62 40.08,111.86 v37.8,109.58 | v71.63,116.89 74.07,116.89 75.29,115.67 IO.13 75.44,115.67 76.35,116.59 85.8,116.59 88.54,113.84 v88.54,101.04
B7  (via drill 0.35)
  Top 0.152: 46.94,20.57 41.91,25.6 38.41,25.6 37.8,26.21 37.8,27.43 43.59,33.22 49.99,33.22 50.9,34.14 R7.2 | 46.94,20.57 48.31,19.2 50.9,19.2 PD7.2 | 59.74,3.5 58.83,2.59 52.43,2.59 46.02,8.99 | 59.74,3.5 59.89,3.66 59.89,4.27 59.28,4.88 58.52,4.88 57.61,3.96 57,3.96 IR.15 | 46.02,8.99 46.02,19.66 46.94,20.57 | ACCUMULATOR.15 96.16,87.33 97.69,87.33 98.91,86.11 98.91,56.39 95.71,53.19 95.71,52.43 ALU.15 95.71,52.27 98.75,49.23 98.75,18.9 98.15,18.29 v97.38,18.29 97.38,13.56 89,5.18 68.73,5.18 67.97,4.42 67.97,3.66 67.21,2.9 60.35,2.9 59.74,3.5 | IO.15 77.27,115.52 76.35,114.61 75.44,114.61 74.37,113.54 74.37,112.78 73.46,111.86 62.48,111.86 59.74,114.61 v59.28,114.61 58.37,115.52 57.76,115.52 55.93,113.69 v55.93,105.31 | MAR.15 6.25,30.79 6.25,31.55 7.62,32.92 7.62,35.05 7.77,35.2 7.77,39.01 3.05,43.74 3.05,76.05 3.66,76.66 5.49,76.66 MEMORY.15 5.64,76.66 6.55,77.57 6.55,78.49 7.62,79.55 8.38,79.55 19.96,91.14 v27.13,91.14 | 46.02,8.99 44.65,8.99 38.71,3.05 22.55,3.05 21.64,3.96 21.64,4.72 20.42,5.94 20.12,5.94 19.66,6.4 19.66,7.16 10.67,16.15 v10.21,16.15
  Bottom 0.152: v97.38,18.29 97.38,18.75 95.4,20.73 95.4,21.34 MBR.15 | v59.28,114.61 58.98,114.3 57.76,114.3 55.93,116.13 46.48,116.13 45.26,114.91 PROGRAM_COUNTER.15 | v55.93,105.31 41.76,91.14 v27.13,91.14 | v10.21,16.15 10.21,28.5 8.99,29.72 7.16,29.72 6.25,30.63 MAR.15
B8  (via drill 0.35)
  Top 0.152: v46.02,25.45 51.97,19.51 51.97,18.9 51.36,18.29 48.77,18.29 48.01,19.05 47.09,19.05 PD8.2 | v61.57,16.76 61.57,14.63 63.09,13.11 63.09,11.58 67.82,6.86 67.82,6.1 68.43,5.49 69.34,5.49 70.26,6.4 70.87,6.4 IR.2 | v61.11,38.25 88.85,38.25 91.59,35.51 92.81,35.51 MBR.2 | v91.9,100.58 92.66,100.58 93.42,101.35 ACCUMULATOR.2 | v45.41,17.68 45.41,12.34 39.01,5.94 38.71,5.94 37.64,4.88 37.64,4.12 36.88,3.35 26.21,3.35 25.6,3.96 25.6,4.72 24.99,5.33 24.84,5.33 23.62,6.55 23.62,7.32 20.42,10.52 17.07,10.52 10.82,16.76 8.69,16.76 MAR.2
  Bottom 0.152: MAR.2 8.69,16.61 9.75,15.54 10.52,15.54 10.82,15.85 10.82,29.87 8.99,31.7 5.79,31.7 5.18,32.31 5.18,58.98 8.08,61.87 8.08,62.48 MEMORY.2 8.23,62.64 9.14,63.55 9.14,64.92 8.38,65.68 7.77,65.68 7.16,66.29 7.16,69.04 7.77,69.65 8.84,69.65 25.15,85.95 25.15,100.58 34.14,109.58 34.14,112.78 33.53,113.39 32.77,113.39 31.85,112.47 31.24,112.47 PROGRAM_COUNTER.2 | v46.02,25.45 46.02,34.14 R8.2 46.02,34.29 46.94,35.2 58.06,35.2 v61.11,38.25 70.26,38.25 89.46,57.45 93.42,57.45 94.03,58.06 94.03,58.83 93.42,59.44 92.66,59.44 88.09,64.01 88.09,85.65 88.39,85.95 89.31,85.95 | v61.57,16.76 49.38,16.76 47.09,19.05 PD8.2 46.94,19.2 v45.41,17.68 | 89.31,94.18 89.31,97.99 v91.9,100.58 | 89.31,94.18 89.31,85.95 | 89.31,85.95 89.31,71.78 92.96,68.12 92.96,66.45 ALU.2 | 89.31,94.18 84.12,94.18 83.82,94.49 83.82,109.73 82.45,111.1 82.45,113.39 81.38,114.45 72.24,114.45 72.08,114.3 68.89,114.3 68.73,114.45 65.38,114.45 64.16,113.23 63.4,113.23 IO.2
B9  (via drill 0.35)
  Top 0.152: v91.29,82.14 91.29,79.86 93.27,77.88 93.27,73 92.05,71.78 92.05,65.99 92.96,65.08 92.96,64.47 ALU.4 92.96,64.31 90.53,61.87 v90.53,46.18 | v37.95,24.54 42.98,19.51 42.98,19.2 PD9.2 | v65.84,11.89 68.73,8.99 68.73,6.55 IR.4 | v81.69,37.03 89.15,37.03 92.81,33.38 MBR.4 | v50.44,108.66 42.52,108.66 40.69,110.49 39.62,110.49 38.1,112.01 38.1,112.78 37.49,113.39 34.75,113.39 33.83,112.47 33.22,112.47 PROGRAM_COUNTER.4 | v23.77,89.31 22.25,87.78 22.25,85.34 9.45,72.54 9.45,65.99 8.23,64.77 MEMORY.4 | v29.57,16.15 21.49,16.15 20.27,17.37 9.91,17.37 8.69,18.59 MAR.4
  Bottom 0.152: v91.29,82.14 91.29,88.39 90.37,89.31 90.37,96.47 93.42,99.52 ACCUMULATOR.4 | v37.95,24.54 39.32,25.91 39.47,25.91 41,27.43 41,34.14 R9.2 | v65.84,11.89 65.84,12.65 64.01,14.48 | 64.01,14.48 62.33,16.15 46.02,16.15 43.13,19.05 PD9.2 42.98,19.2 40.39,19.2 39.17,20.42 33.53,20.42 29.57,16.46 v29.57,16.15 | 64.01,14.48 70.56,21.03 78.64,21.03 90.83,33.22 92.81,33.22 MBR.4 | v90.53,46.18 89,46.18 81.69,38.86 v81.69,37.03 | v50.44,108.66 63.4,108.66 65.38,110.64 65.38,113.08 IO.4 | MAR.4 8.69,18.75 8.69,19.51 9.6,20.42 9.6,27.13 8.99,27.74 8.23,27.74 7.16,28.8 7.16,29.11 6.55,29.72 5.79,29.72 4.88,30.63 4.88,59.13 7.16,61.42 7.16,63.7 8.08,64.62 MEMORY.4 | v23.77,89.31 24.84,90.37 24.84,100.74 33.07,108.97 33.07,112.32 PROGRAM_COUNTER.4
B10  (via drill 0.35)
  Top 0.152: 88.7,87.33 v88.7,85.34 | v90.98,89.61 88.7,87.33 | v52.27,107.29 43.43,107.29 40.54,110.19 39.47,110.19 39.17,110.49 37.64,110.49 35.81,112.32 35.2,112.32 PROGRAM_COUNTER.6 | v37.8,32.46 37.49,32.16 37.49,26.06 43.89,19.66 43.89,18.75 43.43,18.29 42.52,18.29 41.76,19.05 39.01,19.05 PD10.2 | v30.48,16.46 30.18,16.76 22.25,16.76 21.34,17.68 18.75,17.68 15.7,20.73 8.69,20.73 MAR.6 | v26.98,68.43 26.98,67.97 30.02,64.92 30.02,40.23 35.97,34.29 R10.2 | v80.01,87.33 88.7,87.33 | v71.78,95.56 70.87,95.56 v65.08,101.35 | v65.38,8.38 66.75,7.01 66.75,6.55 IR.6
  Bottom 0.152: IR.6 66.9,6.55 66.9,16.46 70.87,20.42 84.89,20.42 85.8,19.51 91.59,19.51 92.51,20.42 93.27,20.42 93.88,21.03 93.88,30.33 92.96,31.24 MBR.6 | v88.7,85.34 88.7,67.36 92.96,63.09 92.96,62.48 ALU.6 | v90.98,89.61 90.98,94.94 93.42,97.38 ACCUMULATOR.6 | 62.94,107.29 56.54,107.29 | 56.54,107.29 v52.27,107.29 | 62.94,107.29 67.36,111.71 67.36,113.08 IO.6 | v37.8,32.46 36.12,34.14 R10.2 | v30.48,16.46 30.94,16.46 34.59,20.12 37.95,20.12 38.86,19.2 PD10.2 39.01,19.05 42.22,15.85 62.18,15.85 65.08,12.95 65.08,11.73 65.38,11.43 v65.38,8.38 | MEMORY.6 8.23,66.75 25.3,66.75 v26.98,68.43 26.98,87.33 28.65,89 40.54,89 56.54,105 56.54,107.29 | v71.78,95.56 v80.01,87.33 | v65.08,101.35 65.08,105.16 62.94,107.29
B11  (via drill 0.35)
  Top 0.152: 93.42,95.25 92.51,94.34 92.51,93.12 93.27,92.35 94.03,92.35 94.49,91.9 94.49,82.91 94.03,82.45 93.12,82.45 92.81,82.75 90.98,82.75 90.68,82.45 90.68,80.01 92.96,77.72 92.96,73.15 91.75,71.93 91.75,66.6 91.44,66.29 v91.44,63.7 91.44,63.25 v86.87,58.67 | 93.42,95.25 87.33,101.35 87.33,115.98 86.11,117.2 75.59,117.2 74.37,115.98 74.37,115.21 73.76,114.61 71.48,114.61 70.1,113.23 69.49,113.23 IO.8 | 93.42,95.25 ACCUMULATOR.8 | PD11.2 34.9,19.2 34.9,21.64 30.02,26.52 30.02,33.22 30.94,34.14 R11.2 30.94,34.29 29.41,35.81 29.41,48.62 25.6,52.43 v25.6,67.97 | v58.37,36.42 71.17,36.42 78.18,29.41 92.81,29.41 MBR.8
  Bottom 0.152: v91.44,63.7 91.44,62.64 92.96,61.11 92.96,60.5 ALU.8 | 16.61,76.96 25.6,85.95 25.6,90.98 29.72,95.1 32,95.1 37.03,100.13 37.03,112.32 PROGRAM_COUNTER.8 | 16.61,76.96 8.99,69.34 8.84,69.34 8.23,68.73 MEMORY.8 | MAR.8 8.53,22.71 8.53,21.95 7.62,21.03 7.62,14.48 16.15,5.94 19.05,5.94 19.66,6.55 19.66,7.32 25.3,12.95 25.3,28.5 30.94,34.14 R11.2 31.09,34.29 33.22,36.42 v58.37,36.42 60.81,38.86 66.29,38.86 70.26,42.82 72.39,42.82 76.96,47.4 76.96,47.55 86.87,57.45 v86.87,58.67 | IR.8 64.77,6.55 64.77,11.73 63.55,12.95 37.03,12.95 34.9,15.09 34.9,19.05 PD11.2 | v25.6,67.97 16.61,76.96
B12  (via drill 0.35)
  Top 0.152: ALU.10 93.12,58.52 93.12,59.13 94.34,60.35 94.34,77.27 93.88,77.72 93.88,78.33 94.79,79.25 94.79,92.05 93.57,93.27 ACCUMULATOR.10 | v51.51,108.05 51.51,108.51 50.75,109.27 42.37,109.27 40.84,110.8 40.69,110.8 39.17,112.32 PROGRAM_COUNTER.10 | 60.96,22.25 60.96,26.06 62.64,27.74 92.51,27.74 92.81,27.43 MBR.10 | 60.96,22.25 60.96,14.78 62.79,12.95 62.79,6.55 IR.10 | PD12.2 30.94,19.2 30.94,25.15 26.06,30.02 26.06,34.14 R12.2 26.06,34.29 26.98,35.2 26.98,50.6 24.99,52.58 24.99,89 24.08,89.92 23.47,89.92 22.55,89 20.73,89 20.42,88.7 20.42,87.48 8.53,75.59 7.77,75.59 7.16,74.98 7.16,72.24 8.08,71.32 8.08,70.71 MEMORY.10 | v61.27,22.25 60.96,22.25
  Bottom 0.152: v51.51,108.05 63.25,108.05 66.45,111.25 66.45,113.54 67.06,114.15 67.82,114.15 68.43,113.54 68.43,112.78 69.04,112.17 70.41,112.17 71.32,113.08 IO.10 71.48,113.23 72.39,114.15 79.7,114.15 80.31,113.54 80.31,112.78 82.45,110.64 82.45,69.04 88.09,63.4 | 88.09,63.4 92.96,58.52 ALU.10 | v61.27,22.25 34.14,22.25 31.09,19.2 PD12.2 | 88.09,63.4 75.89,51.21 73.3,51.21 70.87,48.77 40.54,48.77 26.06,34.29 R12.2
B13  (via drill 0.35)
  Top 0.152: v91.14,66.9 91.14,72.24 v91.44,72.54 | PROGRAM_COUNTER.12 41.3,112.32 41.76,112.32 43.28,110.8 49.68,110.8 53.19,107.29 v53.19,100.74 53.19,92.96 72.54,73.61 72.54,69.95 75.89,66.6 | v87.78,54.25 87.78,54.71 75.89,66.6 | PD13.2 27.13,19.2 27.13,25.15 28.19,26.21 28.19,27.43 21.49,34.14 21.03,34.14 R13.2 20.88,34.29 15.09,40.08 15.09,44.96 11.28,48.77 11.12,48.77 10.06,49.84 v10.06,72.24 | v53.03,7.92 53.03,9.75 52.58,10.21 52.58,12.5 55.93,15.85 55.93,23.77 v55.63,24.08 | v62.64,25.45 v85.65,25.45 | 75.89,66.6 57.76,48.46 v57.76,31.85
  Bottom 0.152: v91.14,66.9 92.66,65.38 93.42,65.38 94.34,64.47 94.34,57.76 93.12,56.54 ALU.12 92.96,56.39 89.92,56.39 v87.78,54.25 | v91.44,72.54 91.44,75.89 94.49,78.94 94.49,83.82 93.88,84.43 93.12,84.43 92.51,85.04 92.51,87.78 93.12,88.39 93.88,88.39 94.49,89 94.49,90.37 93.57,91.29 ACCUMULATOR.12 | v53.19,100.74 60.05,100.74 61.57,99.21 63.86,99.21 73.3,108.66 73.3,113.08 IO.12 | v53.03,7.92 58.83,7.92 60.2,6.55 60.81,6.55 IR.12 | PD13.2 26.98,19.2 25.91,20.27 25.91,24.38 26.21,24.69 32.77,24.69 33.53,23.93 38.25,23.93 38.41,24.08 v55.63,24.08 57.76,24.08 | v10.06,72.24 9.75,72.54 8.23,72.54 MEMORY.12 | v85.65,25.45 92.81,25.45 MBR.12 | v62.64,25.45 59.89,25.45 58.52,24.08 57.76,24.08 | 57.76,24.08 v57.76,31.85
B14  (via drill 0.35)
  Top 0.152: 26.06,24.54 27.89,26.36 27.89,27.28 21.95,33.22 16.92,33.22 16,34.14 R14.2 16,34.29 7.16,43.13 7.16,65.08 7.77,65.68 8.53,65.68 9.14,66.29 9.14,73 8.23,73.91 8.23,74.52 MEMORY.14 | 26.06,24.54 23.01,21.49 23.01,19.2 PD14.2 | v76.5,17.98 76.5,18.44 78.49,20.42 v86.26,20.42 | v49.38,110.19 41.91,110.19 40.08,112.01 40.08,112.62 40.84,113.39 41.45,113.39 42.37,112.47 43.13,112.47 PROGRAM_COUNTER.14 | v64.77,110.95 73.15,110.95 75.29,113.08 IO.14 | v92.51,82.14 92.51,79.1 93.57,78.03 93.57,77.57 94.03,77.11 94.03,64.01 93.42,63.4 92.66,63.4 92.05,62.79 92.05,56.08 92.96,55.17 92.96,54.41 ALU.14 92.96,54.25 91.44,52.73 v91.44,44.96 | v74.98,105.46 78.79,105.46 v80.01,106.68 | v81.23,105.46 92.2,94.49 92.2,90.68 93.42,89.46 ACCUMULATOR.14 | v87.63,32.31 89.61,30.33 95.71,30.33 96.62,29.41 96.62,25.3 95.71,24.38 94.94,24.38 94.03,23.47 92.96,23.47 MBR.14 | v26.52,24.08 26.06,24.54
  Bottom 0.152: v76.5,17.98 76.5,8.23 71.17,2.9 66.6,2.9 65.84,3.66 65.84,4.27 65.23,4.88 57.15,4.88 55.93,6.1 55.93,6.86 56.54,7.47 57.15,7.47 58.06,6.55 58.83,6.55 IR.14 | v86.26,20.42 87.48,20.42 90.37,23.32 92.81,23.32 MBR.14 | v49.38,110.19 51.82,110.19 52.58,110.95 v64.77,110.95 | v92.51,82.14 92.51,84.58 92.2,84.89 92.2,88.09 93.42,89.31 ACCUMULATOR.14 | v74.98,105.46 75.29,105.77 75.29,113.08 IO.14 | v81.23,105.46 v80.01,106.68 | v91.44,44.96 87.63,41.15 v87.63,32.31 79.55,24.23 62.03,24.23 61.27,23.47 33.53,23.47 32.92,24.08 v26.52,24.08
B15  (via drill 0.35)
  Top 0.152: v52.58,110.03 51.51,111.1 47.09,111.1 45.87,112.32 45.26,112.32 PROGRAM_COUNTER.16 | v62.03,110.03 74.22,110.03 74.98,110.8 | 74.98,110.8 77.27,113.08 IO.16 | v81.23,104.55 82.14,103.63 82.14,99.36 93.42,88.09 93.42,87.48 ACCUMULATOR.16 | 74.98,110.8 v76.66,109.12 | MEMORY.16 8.08,76.5 6.86,76.5 5.94,75.59 5.18,75.59 4.42,76.35 3.81,76.35 3.35,75.89 3.35,43.89 12.95,34.29 R15.2 | v95.25,39.78 92.05,42.98 92.05,50.75 92.96,51.66 92.96,52.27 ALU.16 | v35.97,14.94 33.53,17.37 22.55,17.37 20.88,19.05 19.05,19.05 PD15.2 | v52.43,13.56 52.43,12.8 51.97,12.34 51.97,5.94 52.43,5.49 53.34,5.49 53.95,6.1 53.95,6.86 54.56,7.47 55.93,7.47 56.84,6.55 IR.16 | v85.95,62.18 85.95,58.52 v89.92,54.56
  Bottom 0.152: v62.03,110.03 v52.58,110.03 | v76.66,109.12 v81.23,104.55 81.23,103.33 82.14,102.41 82.14,65.99 v85.95,62.18 | R15.2 13.11,34.14 13.11,26.82 18.9,21.03 18.9,19.2 PD15.2 | 85.04,20.73 70.71,20.73 66.6,16.61 66.6,8.69 65.84,7.92 65.84,6.1 65.23,5.49 58.52,5.49 57.61,6.4 57,6.4 IR.16 | 85.04,20.73 85.95,19.81 91.29,19.81 92.81,21.34 MBR.16 | v95.25,39.78 95.25,37.03 93.88,35.66 93.88,33.07 93.12,32.31 91.59,32.31 85.04,25.76 85.04,20.73 | v35.97,14.94 41.76,14.94 43.13,13.56 v52.43,13.56 | v89.92,54.56 90.83,54.56 92.96,52.43 ALU.16
CE
  Bottom 0.152: OR_GATE.3 26.52,88.09 26.52,91.44 29.87,94.79 34.14,94.79 48.77,109.42 48.77,110.64 50.14,112.01 50.14,112.78 51.21,113.84 52.12,113.84 53.03,114.76 PROGRAM_COUNTER.23
CL_CE  (via drill 0.35)
  Top 0.152: v23.77,50.9 23.77,87.94 OR_GATE.2 | v17.68,7.77 17.68,5.33 18.59,4.42 IR_CONTROL.21
  Bottom 0.152: v23.77,50.9 23.77,38.25 19.96,34.44 19.96,14.63 17.68,12.34 v17.68,7.77
CL_HLT
  Bottom 0.152: OR_GATE.5 31.39,87.94 31.39,67.06 12.04,47.7 12.04,27.43 16.46,23.01 16.46,7.01 IR_CONTROL.24
CLK  (via drill 0.35)
  Top 0.152: v53.34,14.17 52.12,14.17 51.66,13.72 51.66,5.79 52.27,5.18 53.65,5.18 54.86,6.4 IR.18 | v62.94,14.17 83.52,14.17 85.34,12.34 93.27,12.34 94.34,13.41 94.34,14.33 95.25,15.24 MBR.21 | v87.94,112.01 87.94,108.36 94.49,101.8 94.49,96.32 95.1,95.71 95.1,94.94 95.71,94.34 96.47,94.34 97.08,93.73 97.08,89 96.47,88.39 95.71,88.39 95.1,87.78 95.1,85.04 95.71,84.43 96.32,84.43 97.08,83.67 97.08,80.31 96.16,79.4 ACCUMULATOR.23 | v4.12,75.74 3.66,75.29 3.66,44.81 14.02,34.44 14.02,33.83 11.89,31.7 8.23,31.7 7.62,31.09 7.62,30.33 8.53,29.41 8.53,28.8 MAR.14 8.69,28.65 12.19,28.65 22.55,18.29 34.44,18.29 v35.51,17.22 | MEMORY.21 5.49,82.75 4.57,83.67 4.57,92.2 2.74,94.03 2.74,103.78 13.26,114.3 13.87,114.3 15.39,115.82 15.7,115.82 CLOCK.3 15.85,115.98 16.76,116.89 20.12,116.89 26.82,110.19 39.01,110.19 v39.62,109.58 50.29,98.91 v51.36,98.91 | v76.2,110.49 78.33,112.62 78.33,113.54 78.94,114.15 79.7,114.15 80.01,114.45 81.53,114.45 82.6,115.52 83.36,115.52 IO.21
  Bottom 0.152: v62.94,14.17 v53.34,14.17 42.98,14.17 39.93,17.22 v35.51,17.22 | v87.94,112.01 85.8,114.15 85.5,114.15 84.12,115.52 83.52,115.52 IO.21 | v4.12,75.74 4.12,81.23 5.49,82.6 MEMORY.21 | v39.62,109.58 43.74,109.58 46.18,112.01 46.18,112.78 46.79,113.39 49.07,113.39 50.44,114.76 51.05,114.76 PROGRAM_COUNTER.21 | v76.2,110.49 76.2,110.03 75.59,109.42 75.59,105.16 69.34,98.91 v51.36,98.91
CO  (via drill 0.35)
  Top 0.152: v22.55,9.3 22.55,13.72 v20.57,15.7 | v38.41,87.48 38.41,109.27 v38.71,109.58
  Bottom 0.152: v22.55,9.3 21.64,8.38 21.64,6.55 20.73,5.64 20.73,4.42 IR_CONTROL.19 | v20.57,15.7 20.57,32.46 24.69,36.58 24.69,59.89 38.41,73.61 v38.41,87.48 | v38.71,109.58 40.54,111.4 43.59,111.4 44.2,112.01 44.2,112.78 44.96,113.54 45.87,113.54 47.09,114.76 PROGRAM_COUNTER.17
GND
  Top 0.152: OR_GATE.7 36.58,87.94 35.2,87.94 34.44,87.17 33.68,87.17 26.52,94.34 26.52,95.86 OR_GATE.12 26.36,96.01 23.93,96.01 OR_GATE.13 23.77,96.01 23.01,96.01 15.24,103.78 13.72,103.78 | 13.72,103.78 13.72,113.23 CLOCK.2 | 13.72,103.78 8.08,98.15 POWER.2 | RST_RELAY.3 68.89,90.07 65.08,90.07 62.03,93.12 FLYBACK_DIODE.A 61.87,93.27 54.1,101.04 54.1,109.88 52.12,111.86 52.12,112.78 51.51,113.39 50.75,113.39 49.84,112.47 49.23,112.47 PROGRAM_COUNTER.20 | 84.43,81.84 77.11,74.52 RESET.A3 | 84.43,81.84 85.95,83.36 93.42,83.36 ACCUMULATOR.20 | 84.43,81.84 79.4,86.87 79.4,105.16 81.23,106.98 81.23,113.08 IO.20 | LED11.K 31.09,50.29 35.97,50.29 LED10.K 36.12,50.29 41,50.29 LED9.K 41.15,50.29 45.87,50.29 LED8.K 46.02,50.29 50.9,50.29 LED7.K | LED15.K 11.12,50.29 15.85,50.29 LED14.K 16,50.29 20.88,50.29 LED13.K 21.03,50.29 25.91,50.29 LED12.K | LED0.K 85.95,50.29 81.08,50.29 LED1.K 80.92,50.29 76.05,50.29 LED2.K 75.89,50.29 71.02,50.29 LED3.K 70.87,50.29 66.14,50.29 LED4.K 65.99,50.29 61.11,50.29 LED5.K | PD12.1 31.09,26.82 34.9,26.82 PD11.1 | MAR.16 8.69,30.63 15.09,30.63 18.9,26.82 PD15.1 19.05,26.82 22.86,26.82 PD14.1 23.01,26.82 26.98,26.82 PD13.1 | PD10.1 39.01,26.82 42.98,26.82 PD9.1 43.13,26.82 46.94,26.82 PD8.1 47.09,26.82 50.9,26.82 PD7.1 51.05,26.82 54.86,26.82 PD6.1 55.02,26.82 57,26.82 | PD0.1 78.94,26.82 75.13,26.82 PD1.1 74.98,26.82 71.02,26.82 PD2.1 70.87,26.82 67.06,26.82 PD3.1 66.9,26.82 63.09,26.82 PD4.1 62.94,26.67 62.03,25.76 62.03,18.9 62.64,18.29 63.4,18.29 66.14,21.03 86.56,21.03 90.22,17.37 92.81,17.37 MBR.20
  Top 0.152: IR.20 52.88,6.55 52.88,6.86 60.66,14.63 60.66,25.15 59.13,26.67 PD5.1 58.98,26.82 57,26.82 | 57,26.82 57,48.01 56.08,48.92 56.08,50.14 LED6.K
  Bottom 0.152: MEMORY.20 8.08,80.77 8.08,81.38 7.16,82.3 7.16,97.23 7.92,97.99 POWER.2 | 75.13,78.03 73.91,79.25 73.91,85.04 69.04,89.92 RST_RELAY.3 | 75.13,78.03 76.96,76.2 76.96,74.52 RESET.A3 | OR_GATE.7 36.73,88.09 56.84,88.09 61.87,93.12 FLYBACK_DIODE.A | LED11.K 30.94,50.29 26.06,50.29 LED12.K | ALU.20 92.96,48.46 87.78,48.46 86.11,50.14 LED0.K | LED7.K 51.05,50.29 55.93,50.29 LED6.K 56.08,50.29 60.96,50.29 LED5.K | PD13.1 27.13,26.82 30.94,26.82 PD12.1 | PD11.1 35.05,26.82 38.86,26.82 PD10.1 | PD5.1 59.13,26.82 62.94,26.82 PD4.1 | 75.13,78.03 71.02,73.91 71.02,50.29 LED3.K
HLT
  Top 0.152: OR_GATE.8 36.58,96.01 35.81,96.01 18.75,113.08 18.75,114.91 17.83,115.82 CLOCK.5
INPUT  (via drill 0.35)
  Top 0.152: v20.12,9.91 20.42,9.91 22.55,7.77 22.55,7.01 IR_CONTROL.18 | v80.01,104.85 80.01,105.31 86.72,112.01 86.72,116.13 85.95,116.89 80.62,116.89 79.4,115.67 IO.17
  Bottom 0.152: v20.12,9.91 20.12,13.87 24.08,17.83 24.08,33.53 40.08,49.53 40.08,64.92 v80.01,104.85
IO_HLT  (via drill 0.35)
  Top 0.152: v58.06,114.91 62.64,110.34 73.91,110.34 76.35,112.78 76.35,113.54 77.42,114.61 79.7,114.61 80.31,115.21 80.31,115.98 80.92,116.59 85.8,116.59 86.41,115.98 86.41,115.21 85.34,114.15 84.43,114.15 83.52,113.23 IO.22
  Bottom 0.152: v58.06,114.91 56.54,116.43 43.28,116.43 42.22,115.37 42.22,114.61 41.45,113.84 37.19,113.84 36.12,112.78 36.12,111.1 31.55,106.53 31.55,96.01 OR_GATE.10
JMP
  Top 0.152: IR_CONTROL.23 16.46,4.42 16.46,5.64 9.14,12.95 9.14,15.39 8.84,15.7 8.38,15.7 7.62,16.46 7.62,28.65 6.55,29.72 5.79,29.72 1.68,33.83 1.68,86.26 2.59,87.17 2.59,93.73 2.44,93.88 2.44,106.38 13.26,117.2 27.43,117.2 30.94,113.69 45.87,113.69 47.09,112.47 PROGRAM_COUNTER.18
MAR_HLT
  Bottom 0.152: OR_GATE.4 28.96,87.94 28.96,69.49 6.25,46.79 6.25,32.77 MAR.17
MARI
  Top 0.152: MAR.10 8.69,24.69 12.19,24.69 18.9,17.98 21.49,17.98 22.4,17.07 30.79,17.07 34.59,13.26 34.59,7.01 IR_CONTROL.6
MBRI  (via drill 0.35)
  Top 0.152: v45.41,18.9 38.71,12.19 38.71,7.01 IR_CONTROL.2 | v89.61,21.64 v69.8,21.64 | v91.14,21.64 92.35,20.42 94.34,20.42 95.25,19.51 MBR.17
  Bottom 0.152: v45.41,18.9 48.16,21.64 v69.8,21.64 | v91.14,21.64 v89.61,21.64
MBRO  (via drill 0.35)
  Top 0.152: v44.65,14.94 v40.23,10.52 | v62.18,14.94 74.37,14.94 78.03,18.59 78.03,19.51 78.64,20.12 85.65,20.12 89.46,16.31 93.12,16.31 93.88,17.07 93.88,18.44 92.96,19.36 MBR.18
  Bottom 0.152: v40.23,10.52 36.73,7.01 IR_CONTROL.4 | v62.18,14.94 v44.65,14.94
N$1
  Top 0.152: R1.1 81.08,41.91 81.08,47.7 LED1.A
N$2
  Top 0.152: R2.1 76.05,41.91 76.05,47.7 LED2.A
N$3
  Top 0.152: R3.1 71.02,41.91 71.02,47.7 LED3.A
N$4
  Top 0.152: R4.1 65.99,41.91 65.99,47.7 LED4.A
N$5
  Top 0.152: R5.1 60.96,41.91 60.96,47.7 LED5.A
N$6
  Top 0.152: R6.1 56.08,41.91 56.08,47.7 LED6.A
N$7
  Top 0.152: R7.1 51.05,41.91 51.05,47.7 LED7.A
N$8
  Top 0.152: R8.1 46.02,41.91 46.02,47.7 LED8.A
N$11
  Top 0.152: OR_GATE.6 34.14,88.09 34.14,95.86 OR_GATE.9
N$13
  Top 0.152: R9.1 41,41.91 41,47.7 LED9.A
N$14
  Top 0.152: R10.1 35.97,41.91 35.97,47.7 LED10.A
N$15
  Top 0.152: R11.1 31.09,41.91 31.09,47.7 LED11.A
N$16
  Top 0.152: R12.1 26.06,41.91 26.06,47.7 LED12.A
N$17
  Top 0.152: R13.1 21.03,41.91 21.03,47.7 LED13.A
N$18
  Top 0.152: R14.1 16,41.91 16,47.7 LED14.A
N$19
  Top 0.152: LED15.A 11.12,47.7 11.12,43.74 12.95,41.91 R15.1
N$20
  Top 0.152: R0.1 85.95,41.91 85.95,47.7 LED0.A
OI
  Bottom 0.152: IR_CONTROL.22 18.75,7.01 18.75,12.95 22.1,16.31 22.1,33.53 24.99,36.42 24.99,51.66 76.05,102.72 76.05,109.42 79.25,112.62 79.25,113.08 IO.18
RI
  Top 0.152: MEMORY.18 8.23,78.64 9.91,78.64 20.57,89.31 22.4,89.31 23.32,90.22 24.23,90.22 25.6,88.85 25.6,68.89 29.72,64.77 29.72,36.88 36.58,30.02 36.58,8.23 35.66,7.32 35.66,6.55 35.05,5.94 33.53,5.94 32.61,6.86 IR_CONTROL.8
RO  (via drill 0.35)
  Top 0.152: v7.16,35.51 2.59,40.08 2.59,76.05 5.03,78.49 5.49,78.49 MEMORY.17 | v11.73,16.76 20.42,16.76 30.18,7.01 30.48,7.01 IR_CONTROL.10
  Bottom 0.152: v7.16,35.51 11.12,31.55 11.12,17.37 v11.73,16.76
RST
  Top 0.152: FLYBACK_DIODE.C 62.03,100.89 63.09,101.96 68.89,101.96 RST_RELAY.2 69.04,101.96 69.8,101.19 | 69.8,101.19 76.96,94.03 76.96,79.55 RESET.B3 | 69.8,101.19 80.31,111.71 80.31,113.39 81.08,114.15 83.21,114.15 84.58,115.52 85.34,115.52 IO.23
SC  (via drill 0.35)
  Top 0.152: v60.05,17.37 v53.19,10.52
  Bottom 0.152: v53.19,10.52 52.73,10.52 48.16,5.94 32.77,5.94 31.24,4.42 30.63,4.42 IR_CONTROL.9 | v60.05,17.37 66.45,17.37 71.78,22.71 79.86,22.71 91.9,34.75 91.9,38.41 98.15,44.65 98.15,68.89 97.08,69.95 97.08,80.47 96.16,81.38 ACCUMULATOR.21
SU
  Bottom 0.152: ALU.18 93.12,50.29 94.34,49.07 94.34,44.2 88.24,38.1 88.24,32 79.55,23.32 61.57,23.32 61.42,23.16 33.22,23.16 25.6,15.54 25.6,9.3 23.62,7.32 23.62,5.33 22.71,4.42 IR_CONTROL.17
SWITCHVCC  (via drill 0.35)
  Top 0.152: v94.49,78.03 95.1,78.64 95.1,81.84 96.01,82.75 96.01,83.36 ACCUMULATOR.19 | v92.05,75.59 88.09,75.59 85.34,72.85 | 85.34,72.85 77.27,72.85 75.89,74.22 75.89,87.02 67.06,95.86 RST_RELAY.1 | v34.14,17.68 22.71,17.68 13.72,26.67 8.69,26.67 MAR.12 | v56.08,9.14 56.08,8.53 57.91,6.71 57.91,6.1 56.69,4.88 53.8,4.88 52.88,3.96 IR.19 | v63.7,11.89 64.31,12.5 66.14,12.5 66.6,12.04 95.4,12.04 96.32,12.95 96.32,15.85 95.4,16.76 95.4,17.22 MBR.19 95.4,17.37 98.15,20.12 98.15,32.46 96.93,33.68 96.93,37.19 89.92,44.2 89.92,53.49 85.34,58.06 85.34,72.85
  Bottom 0.152: v92.05,75.59 v94.49,78.03 | v34.14,17.68 34.14,15.39 38.41,11.12 54.1,11.12 v56.08,9.14 58.83,11.89 v63.7,11.89
VCC  (via drill 0.35)
  Top 0.152: 7.77,96.01 21.34,96.01 OR_GATE.14 21.49,95.86 22.71,95.86 26.67,91.9 v28.04,91.9 | 7.77,96.01 6.4,97.38 6.4,100.43 7.92,101.96 POWER.1 | 7.77,96.01 7.16,95.4 7.16,82.75 5.64,81.23 5.64,80.77 MEMORY.19 | v92.05,41 92.05,41.6 88.39,45.26 88.39,54.56 73.15,69.8 73.15,74.37 RESET.A1 | 55.32,105 55.32,111.56 53.19,113.69 50.9,113.69 49.84,114.76 49.23,114.76 PROGRAM_COUNTER.19 | 55.32,105 74.98,85.34 74.98,79.55 RESET.B2 | v84.43,94.79 84.43,93.27 81.23,90.07 RST_RELAY.5 | 55.32,105 v54.71,105
  Bottom 0.152: CLOCK.1 13.72,115.82 13.72,114.76 8.08,109.12 8.08,102.11 POWER.1 | RESET.A1 73.15,74.37 73.76,74.37 74.52,73.61 77.42,73.61 78.03,74.22 78.03,76.5 75.13,79.4 RESET.B2 75.13,79.55 81.08,85.5 81.08,89.92 RST_RELAY.5 | v92.05,41 95.56,44.5 95.56,48.31 ALU.19 | v84.43,94.79 84.43,113.54 83.82,114.15 83.52,114.15 82.14,115.52 81.38,115.52 IO.19 | v28.04,91.9 41.6,91.9 v54.71,105

### Text on the board
bNames: MARIE PC / BUS / Architecture design by: Dr. Linda Null / Hardware implementation by: Richard Bowser